# EAGLE design ControlPCB_2025-04-28 (EAGLE 9.6.2)
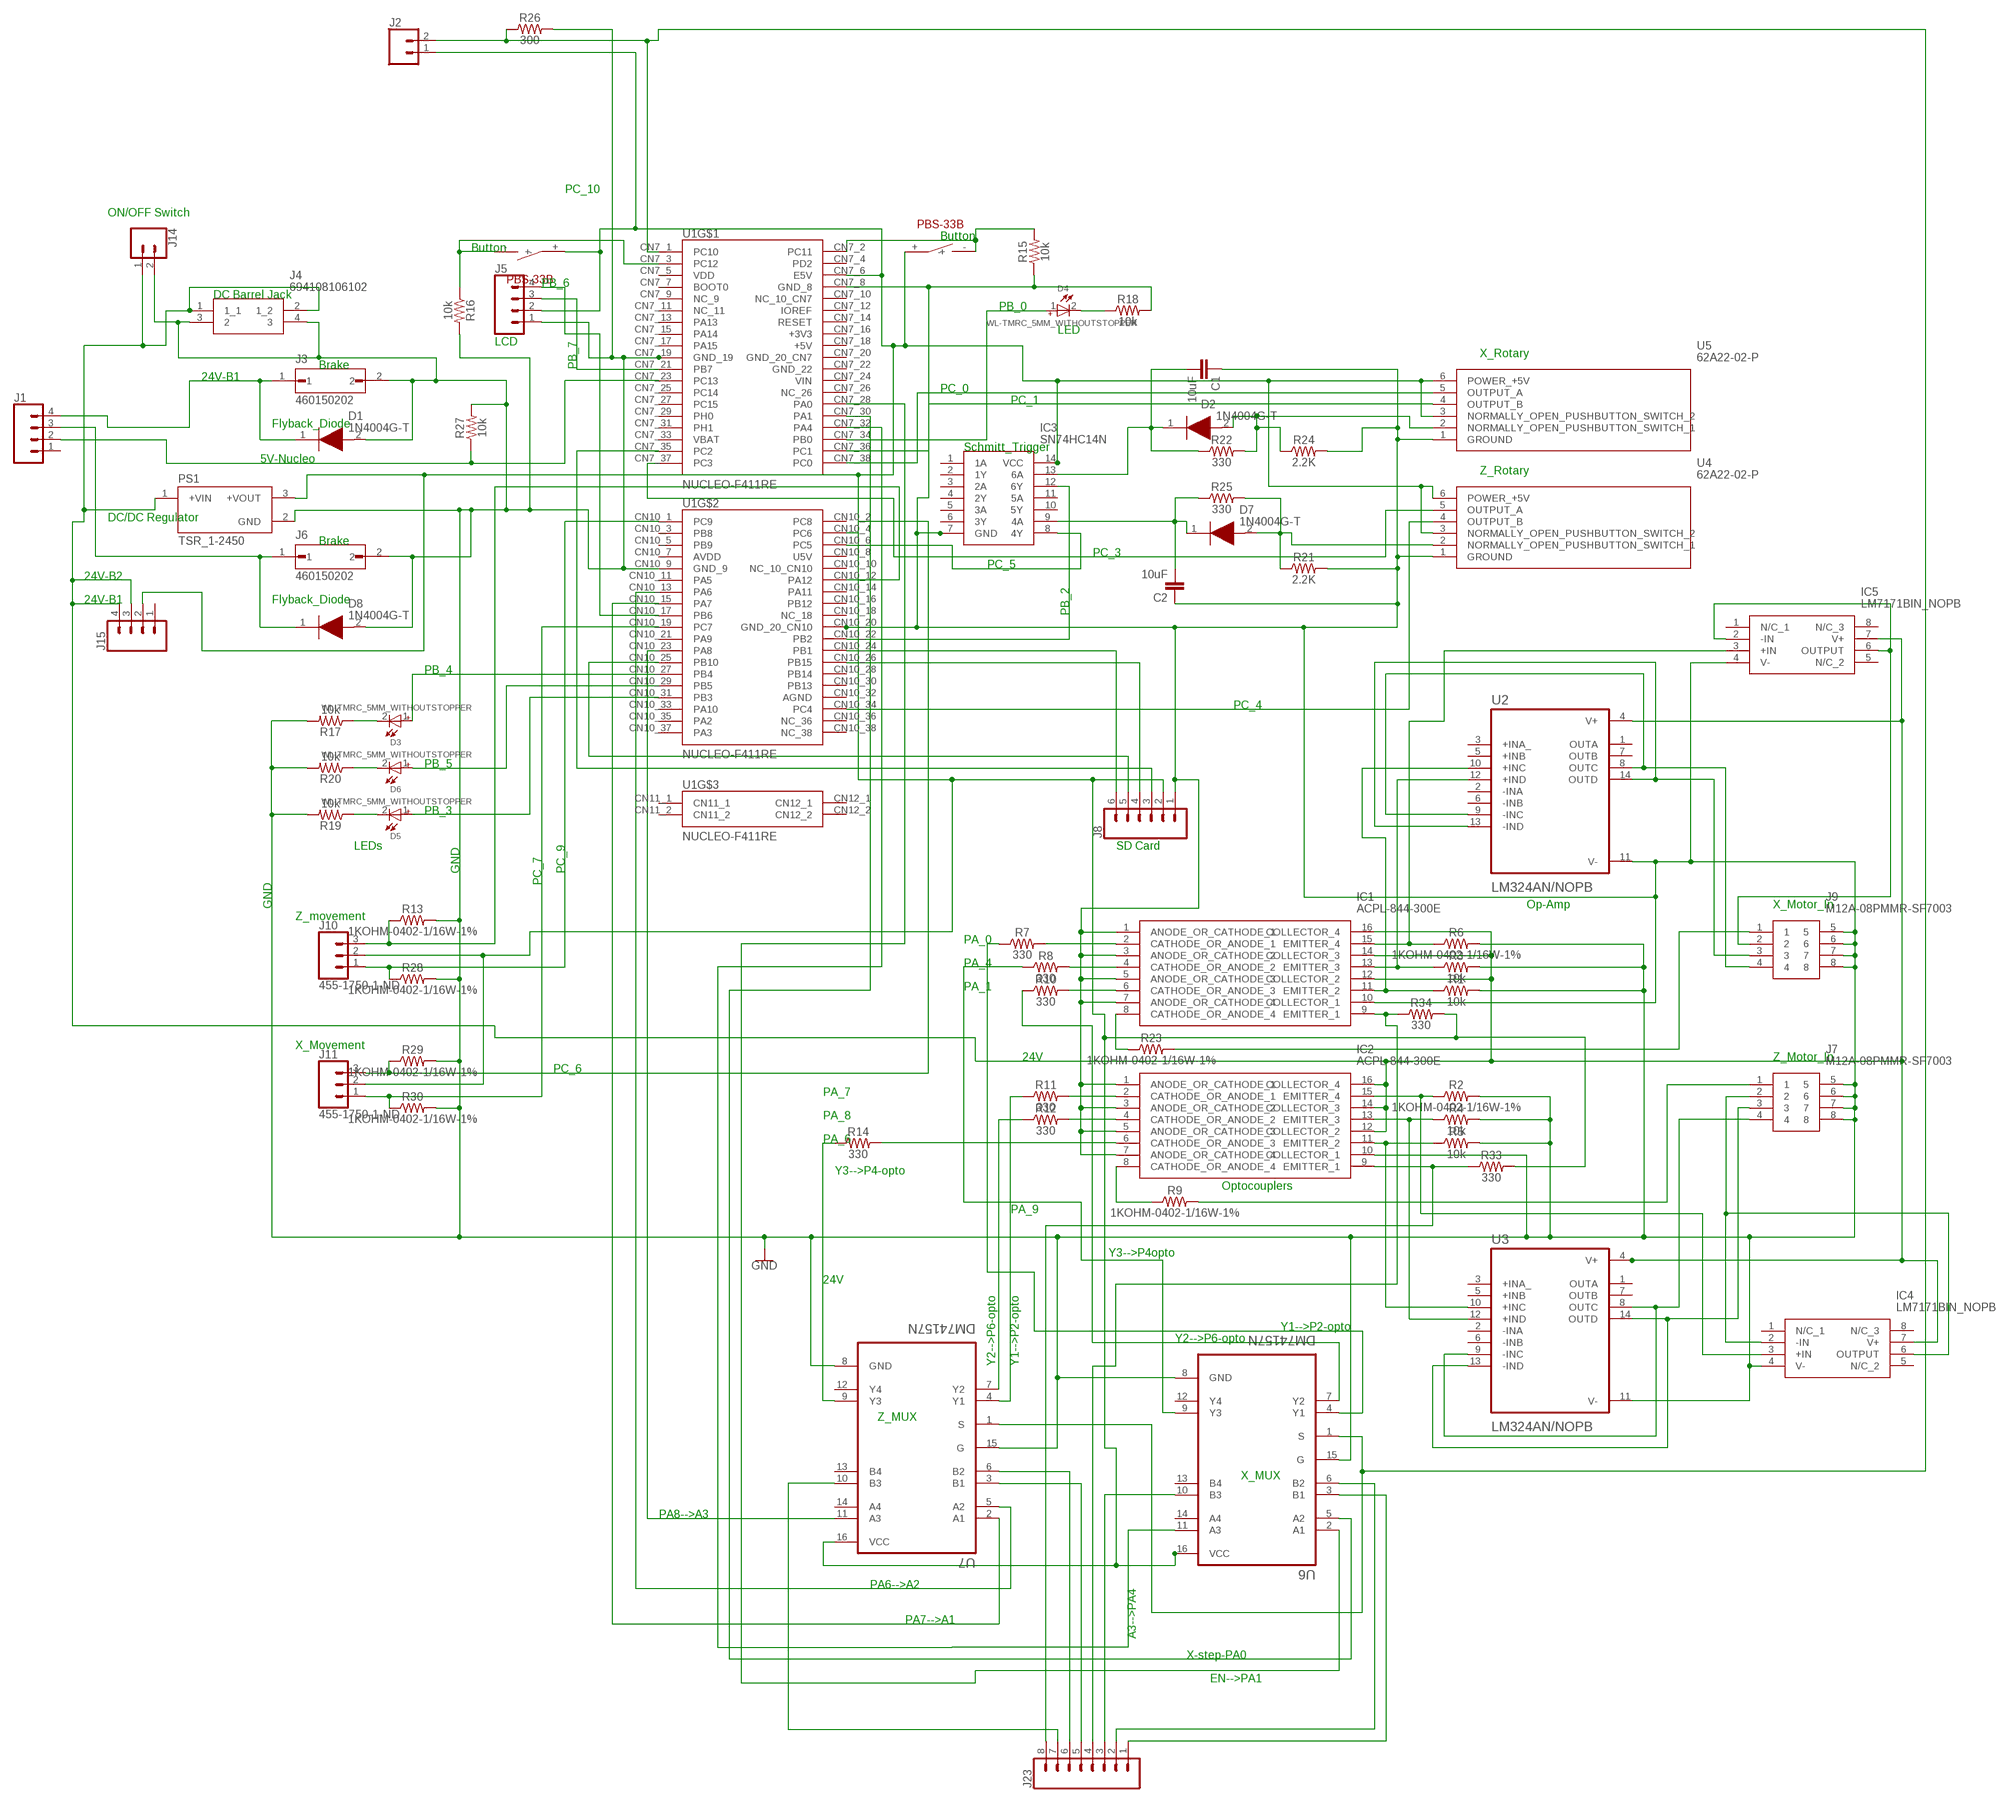
[diagram p0: schematic, sheet 1]

## Parts
C1  10uF  10UF-0603-6.3V-20%  [0603]
C2  10uF  10UF-0603-6.3V-20%  [0603]
D1  1N4004G-T  [DIOAD1408W86L464D236]
D2  1N4004G-T  [DIOAD1408W86L464D236]
D3  WL-TMRC_5MM_WITHOUTSTOPPER  [WL-TMRC_5MM]
D4  WL-TMRC_5MM_WITHOUTSTOPPER  [WL-TMRC_5MM]
D5  WL-TMRC_5MM_WITHOUTSTOPPER  [WL-TMRC_5MM]
D6  WL-TMRC_5MM_WITHOUTSTOPPER  [WL-TMRC_5MM]
D7  1N4004G-T  [DIOAD1408W86L464D236]
D8  1N4004G-T  [DIOAD1408W86L464D236]
IC1  ACPL-844-300E  [DIP880W60P254L1984H450Q16N]
IC2  ACPL-844-300E  [DIP880W60P254L1984H450Q16N]
IC3  SN74HC14N  [DIP794W53P254L1930H508Q14N]
IC4  LM7171BIN_NOPB  [DIP794W53P254L959H508Q8N]
IC5  LM7171BIN_NOPB  [DIP794W53P254L959H508Q8N]
J1  CONN_04PTH  [1X04]
J2  CONN_02  [1X02]
J3  460150202  [MOLEX_460150202]
J4  694108106102  [694108106102]
J5  CONN_04LOCK  [1X04_LOCK]
J6  460150202  [MOLEX_460150202]
J7  M12A-08PMMR-SF7003  [M12A08PMMRSF7003]
J8  CONN_06SILK_FEMALE_PTH  [1X06]
J9  M12A-08PMMR-SF7003  [M12A08PMMRSF7003]
J10  455-1750-1-ND  CONN_03  [1X03]
J11  455-1750-1-ND  CONN_03  [1X03]
J14  CONN_02  [1X02]
J15  CONN_04PTH  [1X04]
J23  CONN_08"  [1X08]
PS1  TSR_1-2450  [CONV_TSR_1-2450]
R1  10k  10KOHM-0402-1/16W-1%  [0402]
R2  1KOHM-0402-1/16W-1%  [0402]
R3  10k  10KOHM-0402-1/16W-1%  [0402]
R4  10k  10KOHM-0402-1/16W-1%  [0402]
R5  10k  10KOHM-0402-1/16W-1%  [0402]
R6  1KOHM-0402-1/16W-1%  [0402]
R7  330  330OHM-0402-1/16W-5%  [0402]
R8  330  330OHM-0402-1/16W-5%  [0402]
R9  1KOHM-0402-1/16W-1%  [0402]
R10  330  330OHM-0402-1/16W-5%  [0402]
R11  330  330OHM-0402-1/16W-5%  [0402]
R12  330  330OHM-0402-1/16W-5%  [0402]
R13  1KOHM-0402-1/16W-1%  [0402]
R14  330  330OHM-0402-1/16W-5%  [0402]
R15  10k  10KOHM-0402-1/16W-1%  [0402]
R16  10k  10KOHM-0402-1/16W-1%  [0402]
R17  10k  10KOHM-0402-1/16W-1%  [0402]
R18  10k  10KOHM-0402-1/16W-1%  [0402]
R19  10k  10KOHM-0402-1/16W-1%  [0402]
R20  10k  10KOHM-0402-1/16W-1%  [0402]
R21  2.2K  2.2KOHM-0402-1/16W-1%  [0402]
R22  330  330OHM-0402-1/16W-5%  [0402]
R23  1KOHM-0402-1/16W-1%  [0402]
R24  2.2K  2.2KOHM-0402-1/16W-1%  [0402]
R25  330  330OHM-0402-1/16W-5%  [0402]
R26  300  300OHM-0603-1/10W-1%  [0603]
R27  10k  10KOHM-0402-1/16W-1%  [0402]
R28  1KOHM-0402-1/16W-1%  [0402]
R29  1KOHM-0402-1/16W-1%  [0402]
R30  1KOHM-0402-1/16W-1%  [0402]
R33  330  330OHM-0402-1/16W-5%  [0402]
R34  330  330OHM-0402-1/16W-5%  [0402]
U1  NUCLEO-F411RE  [BOARD_NUCLEO-F411RE]
U2  LM324AN/NOPB  [DIP794W45P254L1969H508Q14]
U3  LM324AN/NOPB  [DIP794W45P254L1969H508Q14]
U4  62A22-02-P  [62A2202P]
U5  62A22-02-P  [62A2202P]
U6  DM74157N  [DIP794W45P254L1918H533Q16]
U7  DM74157N  [DIP794W45P254L1918H533Q16]
U$1  PBS-33B  [PBS-33B]
U$2  PBS-33B  [PBS-33B]

## Nets
GND: C1.1 C2.1 D1.2(A) D8.2(A) IC1.1(ANODE_OR_CATHODE_1) IC1.3(ANODE_OR_CATHODE_2) IC1.5(ANODE_OR_CATHODE_3) IC1.7(ANODE_OR_CATHODE_4) IC1.10(COLLECTOR_1) IC2.1(ANODE_OR_CATHODE_1) IC2.3(ANODE_OR_CATHODE_2) IC2.5(ANODE_OR_CATHODE_3) IC2.7(ANODE_OR_CATHODE_4) IC2.10(COLLECTOR_1) IC3.7(GND) IC4.4(V-) IC5.4(V-) J3.2 J4.3 J4.4 J5.1 J6.2 J7.5 J7.6 J7.7 J7.8 J8.1 J9.5 J9.6 J9.7 J9.8 J14.2 PS1.2(GND) R1.2 R2.2 R3.2 R4.2 R5.2 R6.2 R13.2 R15.1 R16.2 R17.2 R18.2 R19.2 R20.2 R21.2 R24.2 R26.2 R27.2 R28.2 R29.2 R30.2 U1.CN7_8(GND_8) U1.CN7_19(GND_19) U1.CN10_9(GND_9) U1.CN10_20(GND_20_CN10) U2.11(V-) U3.11(V-) U4.1(GROUND) U5.1(GROUND) U6.8(GND) U6.15(G) U7.8(GND) U7.15(G)
N$1: J10.1 R28.1 U1.CN10_1(PC9)
N$2: J9.4 U2.8(OUTC) U2.9(-INC)
N$3: C2.2 D7.1(K) IC3.9(4A) R25.1
N$4: IC2.9(EMITTER_1) J23.8 R33.1
N$5: IC2.2(CATHODE_OR_ANODE_1) R11.2
N$6: D8.1(K) J1.3 J6.1
N$7: J7.3 U3.13(-IND) U3.14(OUTD)
N$8: IC2.8(CATHODE_OR_ANODE_4) R9.1
N$9: IC3.14(VCC) J2.1 J5.2 J8.2 J10.2 J11.2 J15.2 PS1.3(+VOUT) R33.2 R34.2 U1.CN7_6(E5V) U4.3(NORMALLY_OPEN_PUSHBUTTON_SWITCH_2) U4.6(POWER_+5V) U5.3(NORMALLY_OPEN_PUSHBUTTON_SWITCH_2) U5.6(POWER_+5V) U6.16(VCC) U7.16(VCC) U$1.+ U$2.+
N$10: J7.4 U3.8(OUTC) U3.9(-INC)
N$11: D1.1(K) J1.4 J3.1
N$12: J7.1 R9.2
N$13: IC1.4(CATHODE_OR_ANODE_2) R8.2
N$14: IC4.2(-IN) IC4.6(OUTPUT) J7.2
N$15: R10.1 U6.7(Y2)
N$16: IC1.15(EMITTER_4) IC5.3(+IN) R6.1
N$17: J23.7 U7.10(B3)
N$19: J23.6 U7.6(B2)
N$20: IC1.8(CATHODE_OR_ANODE_4) R23.1
N$21: IC5.2(-IN) IC5.6(OUTPUT) J9.2
N$22: J23.5 U7.3(B1)
N$23: J1.2 R27.1 U1.CN7_23(PC13)
N$25: R16.1 U1.CN7_3(PC12) U$2.-
N$26: R15.2 U1.CN7_2(PC11) U$1.-
N$27: IC3.12(6Y) U1.CN10_22(PB2)
N$28: U1.CN7_32(PA4) U6.11(A3)
N$29: IC2.11(EMITTER_2) R5.1 U3.10(+INC)
N$30: U1.CN7_37(PC3) U4.5(OUTPUT_A)
N$32: R12.1 U7.7(Y2)
N$34: IC1.2(CATHODE_OR_ANODE_1) R7.2
N$35: IC1.12(COLLECTOR_2) IC1.14(COLLECTOR_3) IC1.16(COLLECTOR_4) IC2.12(COLLECTOR_2) IC2.14(COLLECTOR_3) IC2.16(COLLECTOR_4) IC4.7(V+) IC5.7(V+) J4.1(1_1) J4.2(1_2) J14.1 J15.3 J15.4 PS1.1(+VIN) U2.4(V+) U3.4(V+)
N$36: R7.1 U6.4(Y1)
N$38: IC1.6(CATHODE_OR_ANODE_3) R10.2
N$39: IC2.4(CATHODE_OR_ANODE_2) R12.2
N$40: U1.CN10_15(PA7) U7.2(A1)
N$41: D7.2(A) R21.1 R25.2 U4.2(NORMALLY_OPEN_PUSHBUTTON_SWITCH_1)
N$42: R11.1 U7.4(Y1)
N$43: U1.CN7_38(PC0) U5.5(OUTPUT_A)
N$44: IC1.9(EMITTER_1) J23.4 R34.1
N$45: J9.3 U2.13(-IND) U2.14(OUTD)
N$46: U1.CN10_34(PC4) U4.4(OUTPUT_B)
N$47: C1.2 D2.1(K) IC3.13(6A) R22.1
N$49: D4.1(+) U1.CN7_34(PB0)
N$50: J5.4 U1.CN10_17(PB6)
N$51: D6.2(-) R20.1
N$52: D5.2(-) R19.1
N$53: D4.2(-) R18.1
N$54: D3.2(-) R17.1
N$55: J8.4 U1.CN10_26(PB15)
N$56: J8.5 U1.CN10_25(PB10)
N$57: R14.1 U7.9(Y3)
N$58: J9.1 R23.2
N$60: U1.CN10_13(PA6) U7.5(A2)
N$61: U1.CN7_30(PA1) U6.5(A2)
N$62: U1.CN7_28(PA0) U6.2(A1)
N$65: D3.1(+) U1.CN10_27(PB4)
N$66: D6.1(+) U1.CN10_29(PB5)
N$67: J5.3 U1.CN7_21(PB7)
N$68: J23.3 U6.10(B3)
N$69: J23.2 U6.6(B2)
N$70: D5.1(+) U1.CN10_31(PB3)
N$71: U1.CN10_23(PA8) U7.11(A3)
N$73: U1.CN7_36(PC1) U5.4(OUTPUT_B)
N$74: J23.1 U6.3(B1)
N$75: D2.2(A) R22.2 R24.1 U5.2(NORMALLY_OPEN_PUSHBUTTON_SWITCH_1)
N$76: J8.6 U1.CN10_24(PB1)
N$77: IC3.8(4Y) U1.CN10_6(PC5)
N$78: J8.3 U1.CN7_35(PC2)
N$81: J2.2 R26.1 U1.CN7_1(PC10) U6.1(S) U7.1(S)
N$82: J10.3 R13.1 U1.CN10_12(PA12)
N$84: J11.3 R29.1 U1.CN10_4(PC6)
N$87: J11.1 R30.1 U1.CN10_19(PC7)
N$88: IC1.13(EMITTER_3) R3.1 U2.12(+IND)
N$89: IC2.13(EMITTER_3) R4.1 U3.12(+IND)
N$94: IC2.6(CATHODE_OR_ANODE_3) R14.2
N$99: R8.1 U6.9(Y3)
N$105: IC1.11(EMITTER_2) R1.1 U2.10(+INC)
N$107: IC2.15(EMITTER_4) IC4.3(+IN) R2.1
Unconnected: IC3.1(1A) IC3.2(1Y) IC3.3(2A) IC3.4(2Y) IC3.5(3A) IC3.6(3Y) IC3.10(5Y) IC3.11(5A) IC4.1(N/C_1) IC4.5(N/C_2) IC4.8(N/C_3) IC5.1(N/C_1) IC5.5(N/C_2) IC5.8(N/C_3) J1.1 J15.1 U1.CN7_4(PD2) U1.CN7_7(BOOT0) U1.CN7_9(NC_9) U1.CN7_10(NC_10_CN7) U1.CN7_11(NC_11) U1.CN7_12(IOREF) U1.CN7_13(PA13) U1.CN7_14(RESET) U1.CN7_15(PA14) U1.CN7_17(PA15) U1.CN7_24(VIN) U1.CN7_25(PC14) U1.CN7_26(NC_26) U1.CN7_27(PC15) U1.CN7_29(PH0) U1.CN7_31(PH1) U1.CN10_2(PC8) U1.CN10_3(PB8) U1.CN10_5(PB9) U1.CN10_10(NC_10_CN10) U1.CN10_11(PA5) U1.CN10_14(PA11) U1.CN10_16(PB12) U1.CN10_18(NC_18) U1.CN10_21(PA9) U1.CN10_28(PB14) U1.CN10_30(PB13) U1.CN10_33(PA10) U1.CN10_35(PA2) U1.CN10_36(NC_36) U1.CN10_37(PA3) U1.CN10_38(NC_38) U1.CN11_1 U1.CN11_2 U1.CN12_1 U1.CN12_2 U2.1(OUTA) U2.2(-INA) U2.3(+INA_) U2.5(+INB) U2.6(-INB) U2.7(OUTB) U3.1(OUTA) U3.2(-INA) U3.3(+INA_) U3.5(+INB) U3.6(-INB) U3.7(OUTB) U6.12(Y4) U6.13(B4) U6.14(A4) U7.12(Y4) U7.13(B4) U7.14(A4)

## Notes on the sheet
- PC_10
- ON/OFF Switch
- Button
- Button
- PB_6
- DC Barrel Jack
- PB_0
- LED
- LCD
- X_Rotary
- Brake | PB_7
- 24V-B1
- PC_0
- PC_1
- Flyback_Diode
- Schmitt_Trigger
- 5V-Nucleo
- Z_Rotary
- DC/DC Regulator
- Brake
- PC_3
- PC_5
- 24V-B2
- 24V-B1 | Flyback_Diode
- PB_2
- PB_4
- PC_4
- PB_5
- PB_3
- LEDs | SD Card
- GND | PC_9
- PC_7
- GND | Op-Amp | X_Motor_In
- Z_movement
- PA_0
- PA_4
- PA_1
- X_Movement
- 24V | Z_Motor_In
- PC_6
- PA_7
- PA_8
- PA_6
- Y3-->P4-opto
- Optocouplers
- PA_9
- Y3-->P4opto
- 24V
- Y2-->P6-opto | Y1-->P2-opto
- Y1-->P2-opto
- Y2-->P6-opto
- Z_MUX
- X_MUX
- PA8-->A3
- PA6-->A2 | A3-->PA4
- PA7-->A1
- X-step-PA0
- EN-->PA1

## Power pins joined to a net without a drawn wire
+3V3: U1.CN7_16(+3V3)
+5V: U1.CN7_18(+5V)
AGND: U1.CN10_32(AGND)
AVDD: U1.CN10_7(AVDD)
GND_20_CN7: U1.CN7_20(GND_20_CN7)
GND_22: U1.CN7_22(GND_22)
U5V: U1.CN10_8(U5V)
VBAT: U1.CN7_33(VBAT)
VDD: U1.CN7_5(VDD)

## Library data of the parts
C1 C2 = SparkFun-Capacitors:10UF: 10.0µF ceramic capacitors A capacitor is a passive two-terminal electrical component used to store electrical energy temporarily in an electric field.; PROD_ID: CAP-11015
D1 D2 D7 D8 = 1N4004G-T:1N4004G-T: Rectifiers 1.0A 400V Source: Datasheet <https://www.diodes.com/assets/Datasheets/ds29002.pdf>; ARROW_PART_NUMBER: 1N4004G-T; ARROW_PRICE-STOCK: https://www.arrow.com/en/products/1n4004g-t/diodes-incorporated?region=nac; DESCRIPTION: Rectifiers 1.0A 400V; HEIGHT: mm; MANUFACTURER_NAME: Diodes Incorporated; MANUFACTURER_PART_NUMBER: 1N4004G-T; MOUSER_PART_NUMBER: 621-1N4004G-T; MOUSER_PRICE-STOCK: https://www.mouser.co.uk/ProductDetail/Diodes-Incorporated/1N4004G-T?qs=rGAXPo9uwV0Lm2ZC2xbEvw%3D%3D
D3-D6 = WL-TMRC_5MM:WL-TMRC_5MM
IC1 IC2 = ACPL-844-300E:ACPL-844-300E: Broadcom, ACPL-844-300E AC Input Phototransistor Output Quad Optocoupler, Surface Mount, 16-Pin PDIP Source: Datasheet <http://www.avagotech.com/docs/AV01-0475EN>; DESCRIPTION: Broadcom, ACPL-844-300E AC Input Phototransistor Output Quad Optocoupler, Surface Mount, 16-Pin PDIP; HEIGHT: 4.5mm; MANUFACTURER_NAME: Avago Technologies; MANUFACTURER_PART_NUMBER: ACPL-844-300E; MOUSER_PART_NUMBER: 630-ACPL-844-300E; MOUSER_PRICE-STOCK: https://www.mouser.co.uk/ProductDetail/Broadcom-Avago/ACPL-844-300E?qs=RuhU64sK2%252BvgcKbLWHwX4Q%3D%3D
IC3 = SN74HC14N:SN74HC14N: Hex invertor,SN74HC14N DIP14 2-6V 25pcs Source: Datasheet <http://componentsearchengine.com/Datasheets/3/SN74HC14N.pdf>; ARROW_PART_NUMBER: SN74HC14N; ARROW_PRICE-STOCK: https://www.arrow.com/en/products/sn74hc14n/texas-instruments?utm_currency=USD&region=nac; DESCRIPTION: Hex invertor,SN74HC14N DIP14 2-6V 25pcs; HEIGHT: 5.08mm; MANUFACTURER_NAME: Texas Instruments; MANUFACTURER_PART_NUMBER: SN74HC14N; MOUSER_PART_NUMBER: 595-SN74HC14N; MOUSER_PRICE-STOCK: https://www.mouser.co.uk/ProductDetail/Texas-Instruments/SN74HC14N?qs=tJ5HNKWh3OVki9FUzGEzjg%3D%3D
IC4 IC5 = LM7171BIN_NOPB:LM7171BIN_NOPB: Texas Instruments LM7171BIN/NOPB Op Amp, 125MHz, 6 28 V, 8-Pin MDIP Source: Datasheet <http://www.ti.com/lit/gpn/lm7171>; ARROW_PART_NUMBER: LM7171BIN/NOPB; ARROW_PRICE-STOCK: https://www.arrow.com/en/products/lm7171binnopb/texas-instruments?region=nac; DESCRIPTION: Texas Instruments LM7171BIN/NOPB Op Amp, 125MHz, 6 28 V, 8-Pin MDIP; HEIGHT: 5.08mm; MANUFACTURER_NAME: Texas Instruments; MANUFACTURER_PART_NUMBER: LM7171BIN/NOPB; MOUSER_PART_NUMBER: 926-LM7171BIN/NOPB; MOUSER_PRICE-STOCK: https://www.mouser.co.uk/ProductDetail/Texas-Instruments/LM7171BIN-NOPB?qs=QbsRYf82W3GfY2rfAj93dw%3D%3D
J1 J5 J15 = SparkFun-Connectors:CONN_04: Multi connection point. Often used as Generic Header-pin footprint for 0.1 inch spaced/style header connections On any of the 0.1 inch spaced packages, you can populate with these: Break Away Headers - Straight <https://www.sparkfun.com/products/116> (PRT-00116) Break Away Male Headers - Right Angle <https://www.sparkfun.com/products/553> (PRT-00553) Female Headers <https://www.sparkfun.com/products/115> (PRT-00115) Break Away Headers - Machine Pin <https://www.sparkfun.com/products/117> (PRT-00117) Break Away Female Headers - Swiss Machine Pin <https://www.sparkfun.com/products/743> (PRT-00743) For SCREWTERMINALS and SPRING TERMINALS visit here: Screw Terimnals on SparkFun.com <https://www.sparkfun.com/search/results?term=Screw+Terminals> (5mm/3.5mm/2.54mm spacing) This device is also useful as a general connection point to wire up your design to another part of your project. Our various solder wires solder well into these plated through hole pads. Hook-Up Wire - Assortment (Stranded, 22 AWG) <https://www.sparkfun.com/products/11375> (PRT-11375) Hook-Up Wire - Assortment (Solid Core, 22 AWG) <https://www.sparkfun.com/products/11367> (PRT-11367) View the entire wire category on our website here <https://www.sparkfun.com/categories/141> Special notes: Molex polarized connector foot print use with SKU : PRT-08231 with associated crimp pins and housings. 1MM SMD Version SKU: PRT-10208; PROD_ID: CONN-09696
J2 J14 = SparkFun-Connectors:CONN_02: Multi connection point. Often used as Generic Header-pin footprint for 0.1 inch spaced/style header connections On any of the 0.1 inch spaced packages, you can populate with these: Break Away Headers - Straight <https://www.sparkfun.com/products/116> (PRT-00116) Break Away Male Headers - Right Angle <https://www.sparkfun.com/products/553> (PRT-00553) Female Headers <https://www.sparkfun.com/products/115> (PRT-00115) Break Away Headers - Machine Pin <https://www.sparkfun.com/products/117> (PRT-00117) Break Away Female Headers - Swiss Machine Pin <https://www.sparkfun.com/products/743> (PRT-00743) For SCREWTERMINALS and SPRING TERMINALS visit here: Screw Terimnals on SparkFun.com <https://www.sparkfun.com/search/results?term=Screw+Terminals> (5mm/3.5mm/2.54mm spacing) This device is also useful as a general connection point to wire up your design to another part of your project. Our various solder wires solder well into these plated through hole pads. Hook-Up Wire - Assortment (Stranded, 22 AWG) <https://www.sparkfun.com/products/11375> (PRT-11375) Hook-Up Wire - Assortment (Solid Core, 22 AWG) <https://www.sparkfun.com/products/11367> (PRT-11367) View the entire wire category on our website here <https://www.sparkfun.com/categories/141> Special notes: Molex polarized connector foot print use with: PRT-08233 with associated crimp pins and housings. 2.54_SCREWTERM for use with PRT-10571. 3.5mm Screw Terminal footprints for PRT-08084 5mm Screw Terminal footprints for use with PRT-08432
J3 J6 = 460150202:460150202; MANUFACTURER: Molex; MAXIMUM_PACKAGE_HEIGHT: 12.80mm; PARTREV: M4; STANDARD: Manufacturer Recommendations
J4 = 694108106102:694108106102: WURTH ELEKTRONIK - 694108106102 - CONNECTOR, POWER ENTRY, JACK, 5A, 24VDC Source: Datasheet <http://katalog.we-online.de/em/datasheet/6941xx106102.pdf>; DESCRIPTION: WURTH ELEKTRONIK - 694108106102 - CONNECTOR, POWER ENTRY, JACK, 5A, 24VDC; HEIGHT: 11mm; MANUFACTURER_NAME: Wurth Elektronik; MANUFACTURER_PART_NUMBER: 694108106102; MOUSER_PART_NUMBER: 710-694108106102; MOUSER_PRICE-STOCK: https://www.mouser.co.uk/ProductDetail/Wurth-Elektronik/694108106102?qs=a9WhcLg8qCwOtilTS%252B%2FAyw%3D%3D
J7 J9 = M12A-08PMMR-SF7003:M12A-08PMMR-SF7003: Sensor Cables / Actuator Cables PANEL SCREW 8 PIN M CONN M PIN Source: Datasheet <https://www.digikey.com/htmldatasheets/production/3171852/0/0/1/m12a-08pmmr-sf7003.pdf>; ARROW_PART_NUMBER: M12A-08PMMR-SF7003; ARROW_PRICE-STOCK: https://www.arrow.com/en/products/m12a-08pmmr-sf7003/amphenol?region=europe; DESCRIPTION: Sensor Cables / Actuator Cables PANEL SCREW 8 PIN M CONN M PIN; HEIGHT: 16.25mm; MANUFACTURER_NAME: Amphenol; MANUFACTURER_PART_NUMBER: M12A-08PMMR-SF7003; MOUSER_PART_NUMBER: 523-M12A08PMMRSF7003; MOUSER_PRICE-STOCK: https://www.mouser.com/Search/Refine.aspx?Keyword=523-M12A08PMMRSF7003
J8 = SparkFun-Connectors:CONN_06: Multi connection point. Often used as Generic Header-pin footprint for 0.1 inch spaced/style header connections On any of the 0.1 inch spaced packages, you can populate with these: Break Away Headers - Straight <https://www.sparkfun.com/products/116> (PRT-00116) Break Away Male Headers - Right Angle <https://www.sparkfun.com/products/553> (PRT-00553) Female Headers <https://www.sparkfun.com/products/115> (PRT-00115) Break Away Headers - Machine Pin <https://www.sparkfun.com/products/117> (PRT-00117) Break Away Female Headers - Swiss Machine Pin <https://www.sparkfun.com/products/743> (PRT-00743) Arduino Stackable Header - 6 Pin <https://www.sparkfun.com/products/9280> (PRT-09280) Screw Terminals 2.54mm Pitch (6-Pin) <https://www.sparkfun.com/products/16499> (PRT-16499) For SCREWTERMINALS and SPRING TERMINALS visit here: Screw Terimnals on SparkFun.com <https://www.sparkfun.com/search/results?term=Screw+Terminals> (5mm/3.5mm/2.54mm spacing) This device is also useful as a general connection point to wire up your design to another part of your project. Our various solder wires solder well into these plated through hole pads. Hook-Up Wire - Assortment (Stranded, 22 AWG) <https://www.sparkfun.com/products/11375> (PRT-11375) Hook-Up Wire - Assortment (Solid Core, 22 AWG) <https://www.sparkfun.com/products/11367> (PRT-11367) View the entire wire category on our website here <https://www.sparkfun.com/categories/141>; PROD_ID: CONN-08437
J10 J11 = SparkFun-Connectors:CONN_03: Multi connection point. Often used as Generic Header-pin footprint for 0.1 inch spaced/style header connections On any of the 0.1 inch spaced packages, you can populate with these: Break Away Headers - Straight <https://www.sparkfun.com/products/116> (PRT-00116) Break Away Male Headers - Right Angle <https://www.sparkfun.com/products/553> (PRT-00553) Female Headers <https://www.sparkfun.com/products/115> (PRT-00115) Break Away Headers - Machine Pin <https://www.sparkfun.com/products/117> (PRT-00117) Break Away Female Headers - Swiss Machine Pin <https://www.sparkfun.com/products/743> (PRT-00743) Stackable Header - 3 Pin (Female, 0.1") <https://www.sparkfun.com/products/13875> (PRT-13875) For SCREWTERMINALS and SPRING TERMINALS visit here: Screw Terimnals on SparkFun.com <https://www.sparkfun.com/search/results?term=Screw+Terminals> (5mm/3.5mm/2.54mm spacing) This device is also useful as a general connection point to wire up your design to another part of your project. Our various solder wires solder well into these plated through hole pads. Hook-Up Wire - Assortment (Stranded, 22 AWG) <https://www.sparkfun.com/products/11375> (PRT-11375) Hook-Up Wire - Assortment (Solid Core, 22 AWG) <https://www.sparkfun.com/products/11367> (PRT-11367) View the entire wire category on our website here <https://www.sparkfun.com/categories/141> Special notes: Molex polarized connector foot print use with SKU : PRT-08232 with associated crimp pins and housings.; PROD_ID: XXX-00000
J23 = SparkFun-Connectors:CONN_08: Multi connection point. Often used as Generic Header-pin footprint for 0.1 inch spaced/style header connections On any of the 0.1 inch spaced packages, you can populate with these: Break Away Headers - Straight <https://www.sparkfun.com/products/116> (PRT-00116) Break Away Male Headers - Right Angle <https://www.sparkfun.com/products/553> (PRT-00553) Female Headers <https://www.sparkfun.com/products/115> (PRT-00115) Break Away Headers - Machine Pin <https://www.sparkfun.com/products/117> (PRT-00117) Break Away Female Headers - Swiss Machine Pin <https://www.sparkfun.com/products/743> (PRT-00743) Arduino Stackable Header - 8 Pin <https://www.sparkfun.com/products/9279> (PRT-09279) For SCREWTERMINALS and SPRING TERMINALS visit here: Screw Terimnals on SparkFun.com <https://www.sparkfun.com/search/results?term=Screw+Terminals> (5mm/3.5mm/2.54mm spacing) This device is also useful as a general connection point to wire up your design to another part of your project. Our various solder wires solder well into these plated through hole pads. Hook-Up Wire - Assortment (Stranded, 22 AWG) <https://www.sparkfun.com/products/11375> (PRT-11375) Hook-Up Wire - Assortment (Solid Core, 22 AWG) <https://www.sparkfun.com/products/11367> (PRT-11367) View the entire wire category on our website here <https://www.sparkfun.com/categories/141> Special notes: Molex polarized connector foot print use with SKU : PRT-08231 with associated crimp pins and housings. 1MM SMD Version SKU: PRT-10208 NOTES ON THE VARIANTS LOCK and LOCK_LONGPADS... This footprint was designed to help hold the alignment of a through-hole component (i.e. 6-pin header) while soldering it into place. You may notice that each hole has been shifted either up or down by 0.005 of an inch from it's more standard position (which is a perfectly straight line). This slight alteration caused the pins (the squares in the middle) to touch the edges of the holes. Because they are alternating, it causes a "brace" to hold the component in place. 0.005 has proven to be the perfect amount of "off-center" position when using our standard breakaway headers. Although looks a little odd when you look at the bare footprint, once you have a header in there, the alteration is very hard to notice. Also,if you push a header all the way into place, it is covered up entirely on the bottom side.; PROD_ID: CONN-08438
PS1 = TSR_1-2450:TSR_1-2450; MANUFACTURER: Traco Power; MAXIMUM_PACKAGE_HEIGHT: 10.6mm; PARTREV: Apr 27, 2020; STANDARD: Manufacturer Recommendations
R1 R3-R5 R15-R20 R27 = SparkFun-Resistors:10KOHM: 10kΩ resistor A resistor is a passive two-terminal electrical component that implements electrical resistance as a circuit element. Resistors act to reduce current flow, and, at the same time, act to lower voltage levels within circuits. - Wikipedia; PROD_ID: RES-14241
R2 R6 R9 R13 R23 R28-R30 = SparkFun-Resistors:1KOHM: 1kΩ resistor A resistor is a passive two-terminal electrical component that implements electrical resistance as a circuit element. Resistors act to reduce current flow, and, at the same time, act to lower voltage levels within circuits. - Wikipedia; PROD_ID: RES-14342
R7 R8 R10-R12 R14 R22 R25 R33 R34 = SparkFun-Resistors:330OHM: 330Ω resistor A resistor is a passive two-terminal electrical component that implements electrical resistance as a circuit element. Resistors act to reduce current flow, and, at the same time, act to lower voltage levels within circuits. - Wikipedia; PROD_ID: RES-15407
R21 R24 = SparkFun-Resistors:2.2KOHM: 2.2kΩ resistor A resistor is a passive two-terminal electrical component that implements electrical resistance as a circuit element. Resistors act to reduce current flow, and, at the same time, act to lower voltage levels within circuits. - Wikipedia; PROD_ID: RES-14341
R26 = SparkFun-Resistors:300OHM: 300Ω resistor A resistor is a passive two-terminal electrical component that implements electrical resistance as a circuit element. Resistors act to reduce current flow, and, at the same time, act to lower voltage levels within circuits. - Wikipedia; PROD_ID: RES-10328
U1 = NUCLEO-F411RE:NUCLEO-F411RE; CHECK_PRICES: https://www.snapeda.com/parts/NUCLEO-F411RE/STMicroelectronics/view-part/?ref=eda; DESCRIPTION: STM32F411RE, mbed-Enabled Development Nucleo-64 STM32F4 ARM® Cortex®-M4 MCU 32-Bit Embedded Evaluation Board; DIGIKEY_PART_NUMBER: 497-14711-ND; MF: STMicroelectronics; MP: NUCLEO-F411RE; PACKAGE: None; SNAPEDA_LINK: https://www.snapeda.com/parts/NUCLEO-F411RE/STMicroelectronics/view-part/?ref=snap
U2 U3 = LM324AN_NOPB:LM324AN/NOPB
U4 U5 = 62A22-02-P:62A22-02-P: Rotary Encoder Optical 16 Quadrature (Incremental) User Selectable Source: Datasheet <https://app-grayhill-website-cms-prod-001.azurewebsites.net/media/sidlewfq/62a-d-v-datasheet.pdf>; ARROW_PART_NUMBER: 62A22-02-P; ARROW_PRICE-STOCK: https://www.arrow.com/en/products/62a22-02-p/grayhill?region=nac; DESCRIPTION: Rotary Encoder Optical 16 Quadrature (Incremental) User Selectable; HEIGHT: 38.78mm; MANUFACTURER_NAME: Grayhill; MANUFACTURER_PART_NUMBER: 62A22-02-P; MOUSER_PART_NUMBER: 706-62A22-02-P; MOUSER_PRICE-STOCK: https://www.mouser.co.uk/ProductDetail/Grayhill/62A22-02-P?qs=ls7QRyWmRk6o89xMir9opA%3D%3D
U6 U7 = DM74157N:DM74157N: Check availability <https://pricing.snapeda.com/parts/DM74157N/ON%20Semiconductor/view-part?ref=eda>; AVAILABILITY: In Stock; CHECK_PRICES: https://www.snapeda.com/parts/DM74157N/Onsemi/view-part/?ref=eda; DESCRIPTION: IC MULTIPLEXER 4 X 2:1 16DIP; MF: ON Semiconductor; MP: DM74157N; PACKAGE: PDIP-16 ON Semiconductor; PRICE: None; SNAPEDA_LINK: https://www.snapeda.com/parts/DM74157N/Onsemi/view-part/?ref=snap
U$1 U$2 = PBS-33B:PBS-33B

## Board
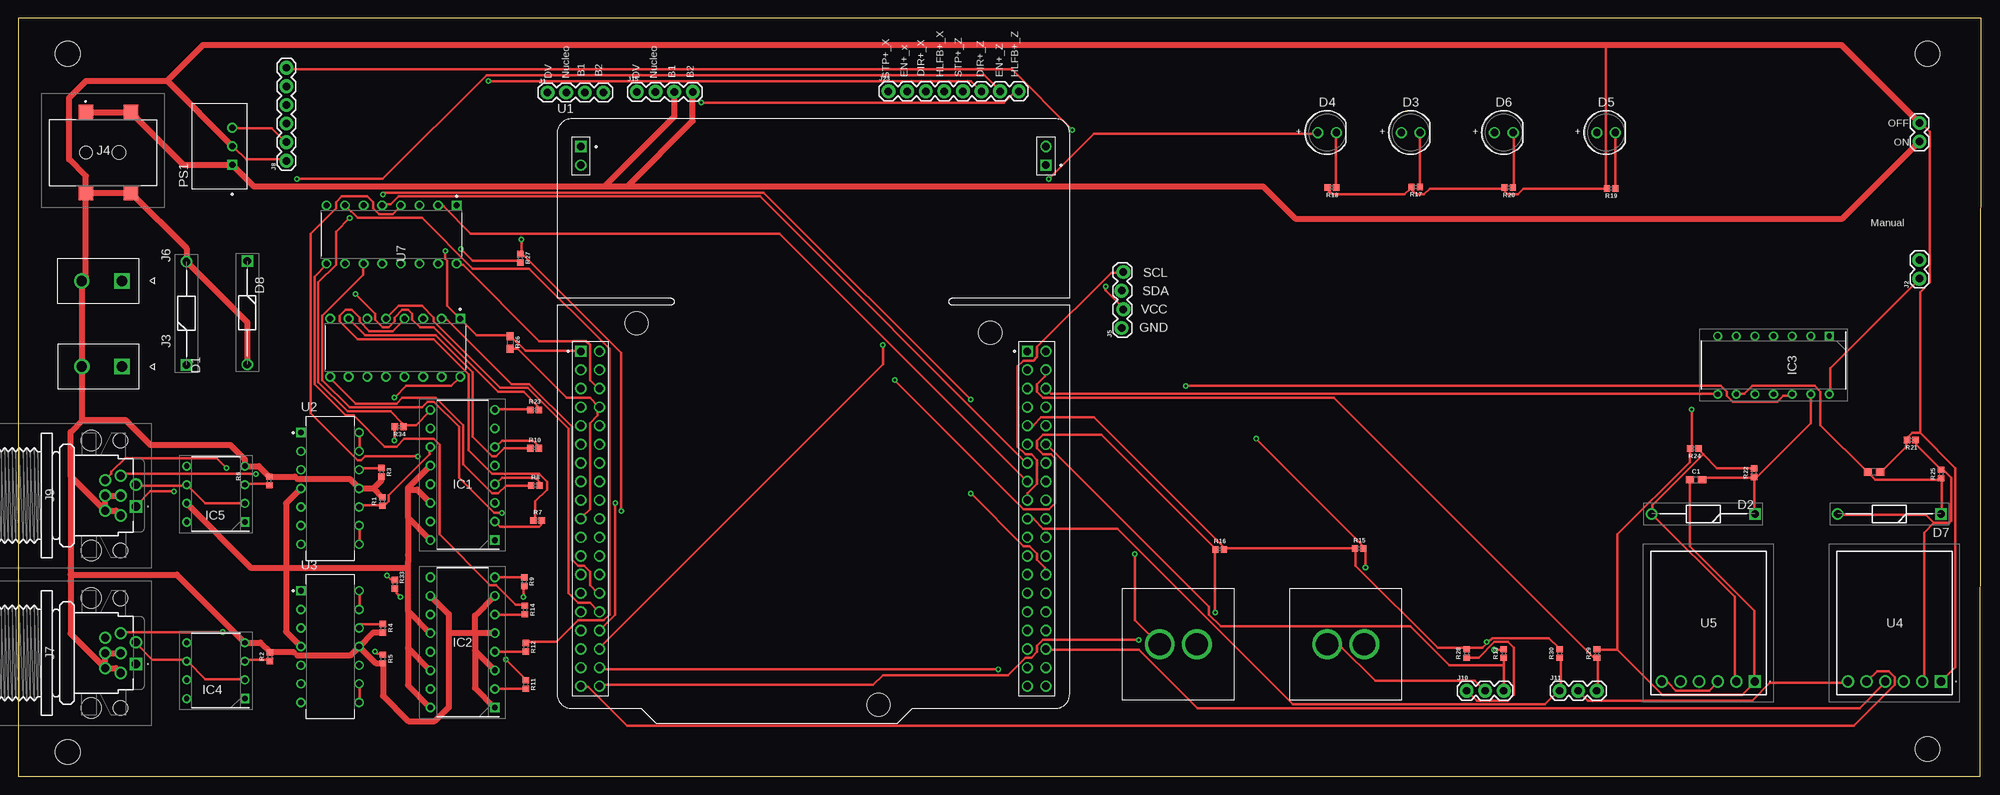
[diagram p1: board, top side]
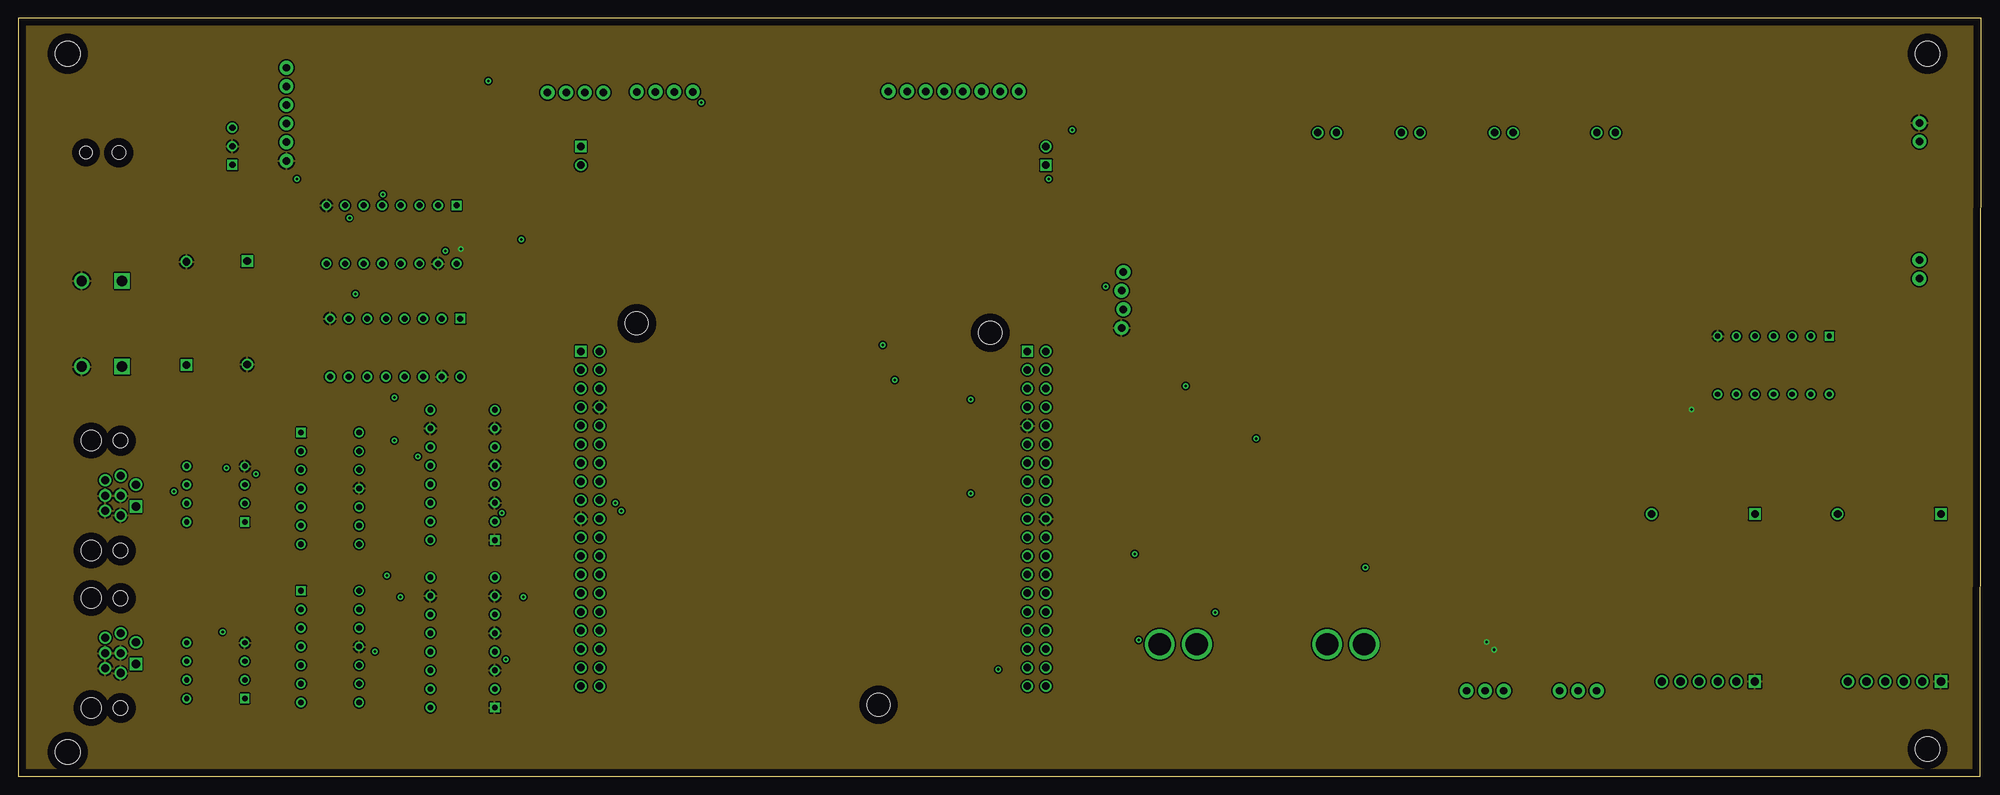
[diagram p2: board, inner layer Route2]
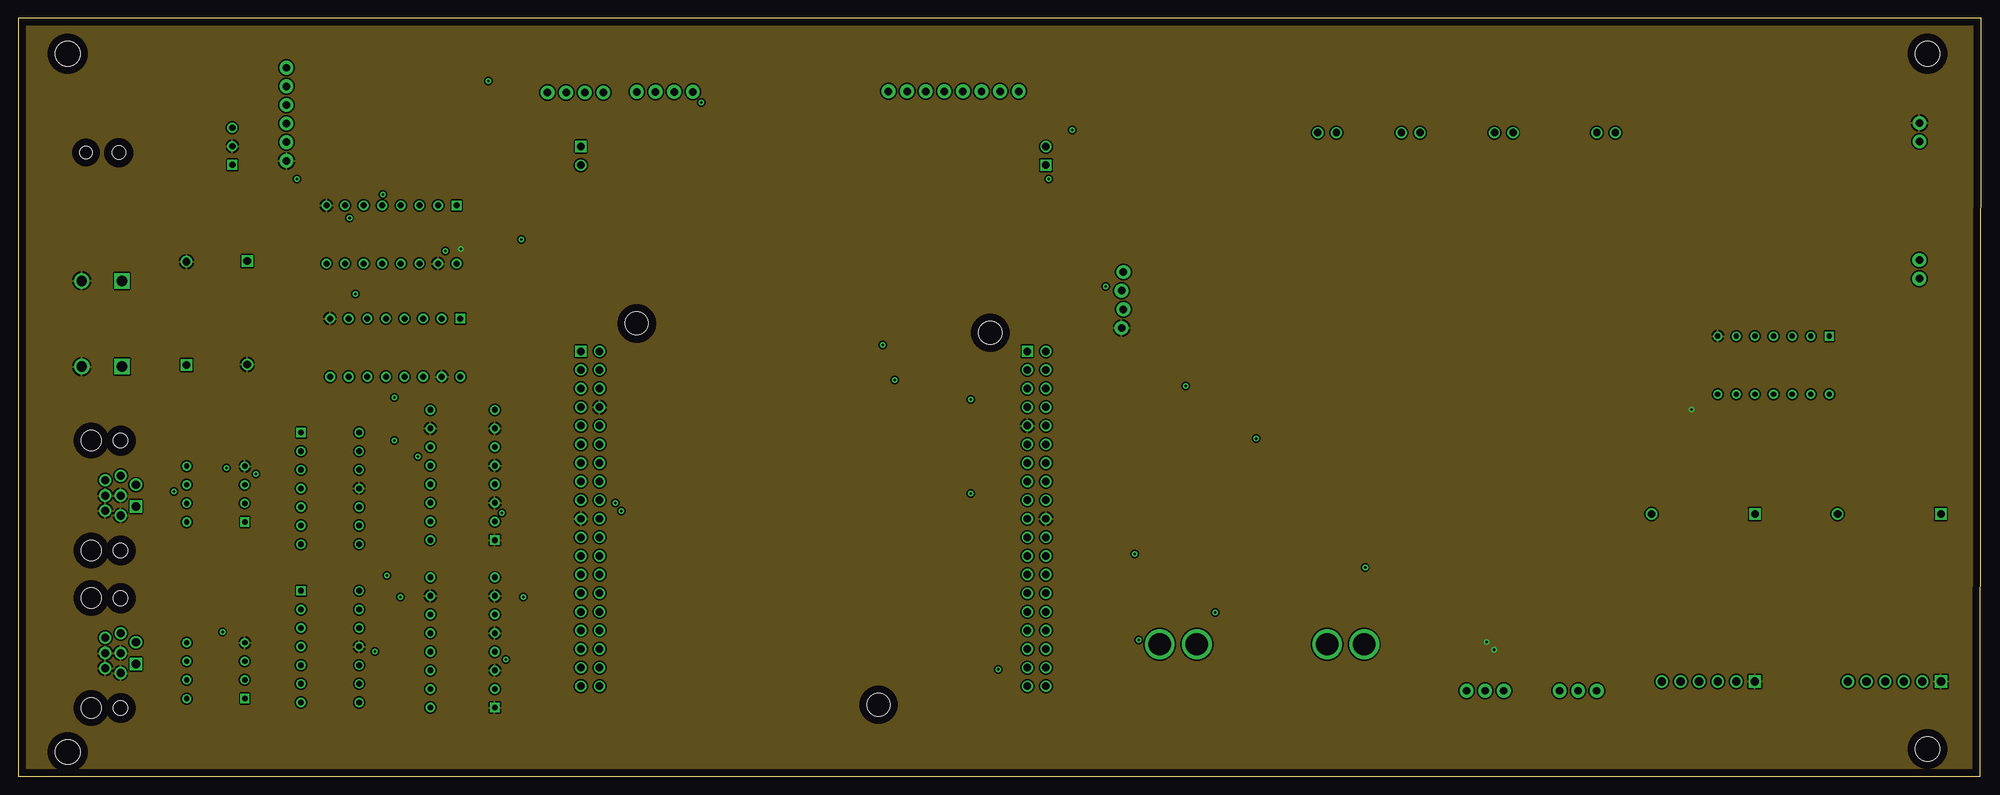
[diagram p3: board, inner layer Route15]
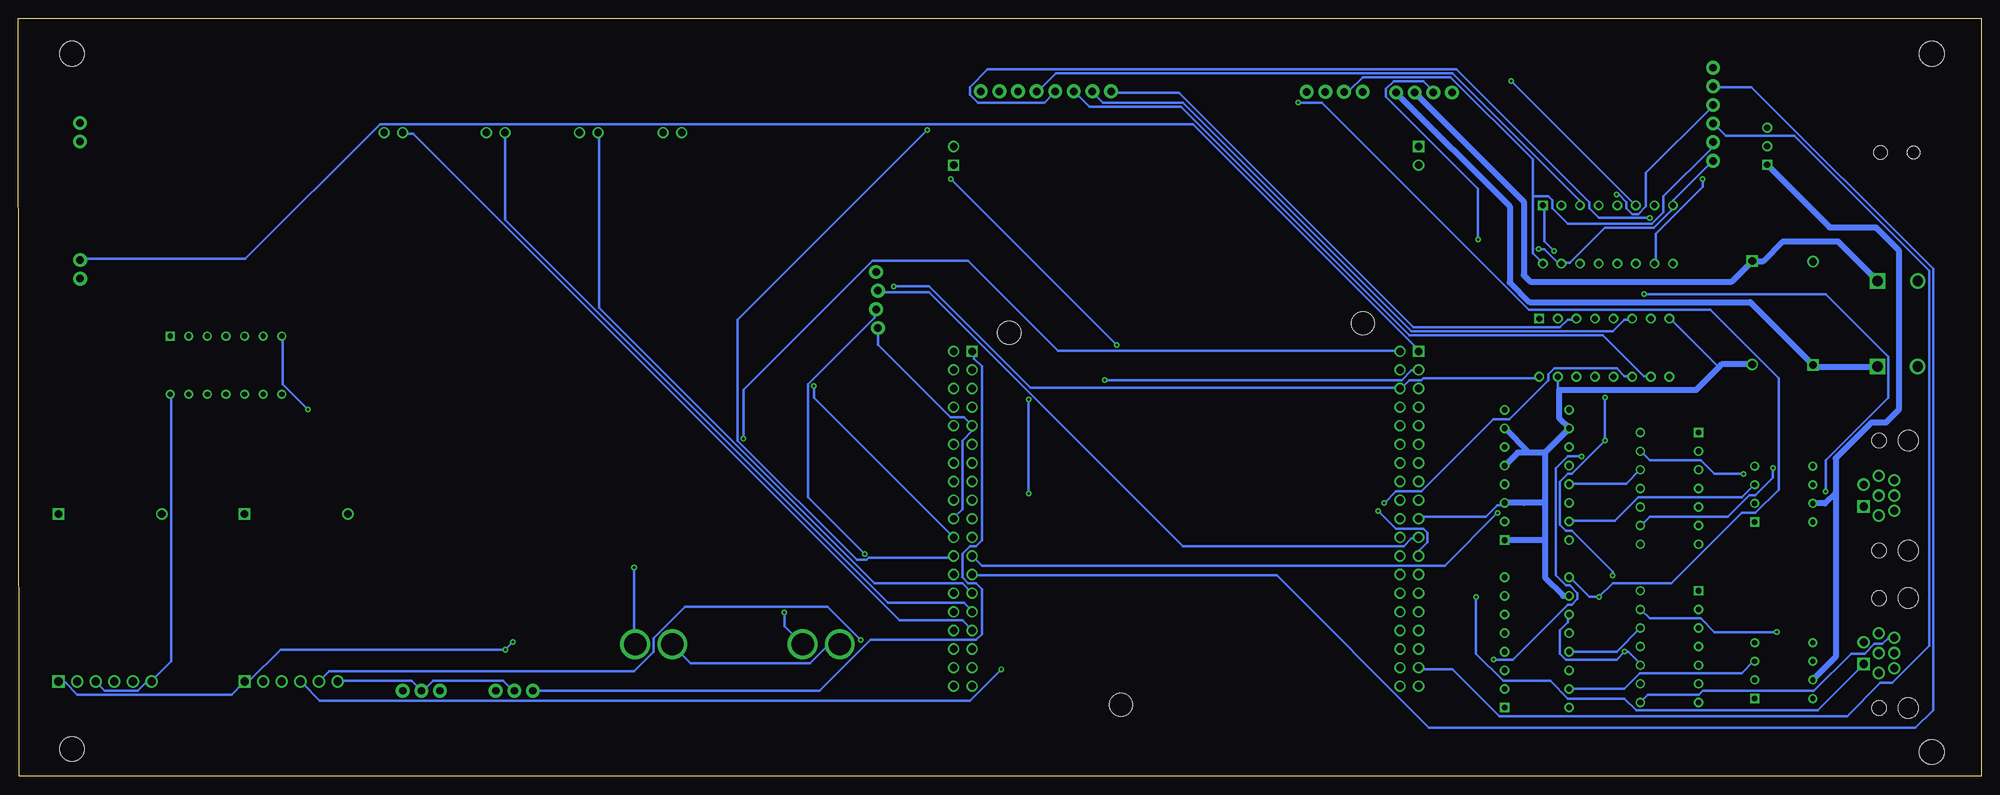
[diagram p4: board, bottom side, seen from below]

Size 268 x 103.46 mm. Coordinates in mm from the lower left corner, seen from the top.
Outline: 0,0 267.9,0 268,103.46 0,103.46 0,0
Copper layers (1+2*15+16): Top 0.035mm / dielectric 0.21mm / Route2 0.035mm / dielectric 1mm / Route15 0.035mm / dielectric 0.21mm / Bottom 0.035mm
Design rules "default *": minimum track width 13mil, minimum drill 0.35mm, track to track 8mil, track to pad 8mil, pad to pad 8mil, via to via 16mil, smd to smd 8mil, copper to edge 40mil, drill to drill 6mil, minimum pad ring 10mil, minimum via ring 8mil, stop-mask expansion 4mil, vias tented up to drill 0mil, thermal gap 10mil
Holes 3.4 mm at 6.76,98.62 6.76,3.32 260.66,3.72 260.66,98.62

### Footprints (pad centres in the part's own frame; a part is rotated, then mirrored left to right if it is on the bottom)
0603 = smd 1.1 x 1: 1 -0.85,0; 2 0.85,0
DIOAD1408W86L464D236 = drill 1.05 pad 1.575 square: 1 0,0 | drill 1.05 pad 1.575: 2 14.1,0
WL-TMRC_5MM = drill 1: 1 -1.27,0; 2 1.27,0
DIP880W60P254L1984H450Q16N = drill 0.8 pad 1.2 square: 1 -4.4,8.89 | drill 0.8 pad 1.2: 2 -4.4,6.35; 3 -4.4,3.81; 4 -4.4,1.27; 5 -4.4,-1.27; 6 -4.4,-3.81; 7 -4.4,-6.35; 8 -4.4,-8.89; 9 4.4,-8.89; 10 4.4,-6.35; 11 4.4,-3.81; 12 4.4,-1.27; 13 4.4,1.27; 14 4.4,3.81; 15 4.4,6.35; 16 4.4,8.89
DIP794W53P254L1930H508Q14N = drill 0.73 pad 1.13 square: 1 -3.97,7.62 | drill 0.73 pad 1.13: 2 -3.97,5.08; 3 -3.97,2.54; 4 -3.97,0; 5 -3.97,-2.54; 6 -3.97,-5.08; 7 -3.97,-7.62; 8 3.97,-7.62; 9 3.97,-5.08; 10 3.97,-2.54; 11 3.97,0; 12 3.97,2.54; 13 3.97,5.08; 14 3.97,7.62
DIP794W53P254L959H508Q8N = drill 0.73 pad 1.13 square: 1 -3.97,3.81 | drill 0.73 pad 1.13: 2 -3.97,1.27; 3 -3.97,-1.27; 4 -3.97,-3.81; 5 3.97,-3.81; 6 3.97,-1.27; 7 3.97,1.27; 8 3.97,3.81
1X04 = drill 1.016 pad 1.88: 1 0,0; 2 2.54,0; 3 5.08,0; 4 7.62,0
1X02 = drill 1.016 pad 1.88: 1 0,0; 2 2.54,0
MOLEX_460150202 = drill 1.4 pad 1.9 square: 1 0,0 | drill 1.4 pad 1.9: 2 0,-5.5
694108106102 = smd 2 x 2: 1 -3.075,5.5; 2 3.075,5.5; 3 -3.075,-5.5; 4 3.075,-5.5 | hole 1.7: -3.075,0 | hole 1.9: 1.425,0
1X04_LOCK = drill 1.016 pad 1.88: 1 0,0.127; 2 2.54,-0.127; 3 5.08,0.127; 4 7.62,-0.127
M12A08PMMRSF7003 = drill 1.1 pad 1.65 square: 1 0,0 | drill 1.1 pad 1.65: 2 -3,0; 3 -4.225,-2.1; 4 -3.575,-4.2; 5 -1.5,-4.2; 6 0.575,-4.2; 7 1.225,-2.1; 8 -1.5,-2.1 | hole 2.05: -9,-2.1; 6,-2.1 | hole 2.8: -9,-6.1; 6,-6.1
1X06 = drill 1.016 pad 1.88: 1 0,0; 2 2.54,0; 3 5.08,0; 4 7.62,0; 5 10.16,0; 6 12.7,0
1X03 = drill 1.016 pad 1.88: 1 0,0; 2 2.54,0; 3 5.08,0
1X08 = drill 1.016 pad 1.88: 1 0,0; 2 2.54,0; 3 5.08,0; 4 7.62,0; 5 10.16,0; 6 12.7,0; 7 15.24,0; 8 17.78,0
CONV_TSR_1-2450 = drill 0.85 square: 1 -2.54,-1.75 | drill 0.85: 2 0,-1.75; 3 2.54,-1.75
0402 = smd 0.85 x 0.9: 1 -0.58,0; 2 0.58,0
BOARD_NUCLEO-F411RE = drill 1.02 square: CN7_1 -31.75,9.51; CN10_1 29.21,9.51; CN11_1 31.75,34.91; CN12_1 -31.75,37.45 | drill 1.02: CN7_2 -29.21,9.51; CN7_3 -31.75,6.97; CN7_4 -29.21,6.97; CN7_5 -31.75,4.43; CN7_6 -29.21,4.43; CN7_7 -31.75,1.89; CN7_8 -29.21,1.89; CN7_9 -31.75,-0.65; CN7_10 -29.21,-0.65; CN7_11 -31.75,-3.19; CN7_12 -29.21,-3.19; CN7_13 -31.75,-5.73; CN7_14 -29.21,-5.73; CN7_15 -31.75,-8.27; CN7_16 -29.21,-8.27; CN7_17 -31.75,-10.81; CN7_18 -29.21,-10.81; CN7_19 -31.75,-13.35; CN7_20 -29.21,-13.35; CN7_21 -31.75,-15.89; CN7_22 -29.21,-15.89; CN7_23 -31.75,-18.43; CN7_24 -29.21,-18.43; CN7_25 -31.75,-20.97; CN7_26 -29.21,-20.97; CN7_27 -31.75,-23.51; CN7_28 -29.21,-23.51; CN7_29 -31.75,-26.05; CN7_30 -29.21,-26.05; CN7_31 -31.75,-28.59; CN7_32 -29.21,-28.59; CN7_33 -31.75,-31.13; CN7_34 -29.21,-31.13; CN7_35 -31.75,-33.67; CN7_36 -29.21,-33.67; CN7_37 -31.75,-36.21; CN7_38 -29.21,-36.21; CN10_2 31.75,9.51; CN10_3 29.21,6.97; CN10_4 31.75,6.97; CN10_5 29.21,4.43; CN10_6 31.75,4.43; CN10_7 29.21,1.89; CN10_8 31.75,1.89; CN10_9 29.21,-0.65; CN10_10 31.75,-0.65; CN10_11 29.21,-3.19; CN10_12 31.75,-3.19; CN10_13 29.21,-5.73; CN10_14 31.75,-5.73; CN10_15 29.21,-8.27; CN10_16 31.75,-8.27; CN10_17 29.21,-10.81; CN10_18 31.75,-10.81; CN10_19 29.21,-13.35; CN10_20 31.75,-13.35; CN10_21 29.21,-15.89; CN10_22 31.75,-15.89; CN10_23 29.21,-18.43; CN10_24 31.75,-18.43; CN10_25 29.21,-20.97; CN10_26 31.75,-20.97; CN10_27 29.21,-23.51; CN10_28 31.75,-23.51; CN10_29 29.21,-26.05; CN10_30 31.75,-26.05; CN10_31 29.21,-28.59; CN10_32 31.75,-28.59; CN10_33 29.21,-31.13; CN10_34 31.75,-31.13; CN10_35 29.21,-33.67; CN10_36 31.75,-33.67; CN10_37 29.21,-36.21; CN10_38 31.75,-36.21; CN11_2 31.75,37.45; CN12_2 -31.75,34.91 | hole 3.2: 8.89,-38.75; 24.13,12.05; -24.13,13.32
DIP794W45P254L1969H508Q14 = drill 0.77 pad 1.17 square: 1 -3.97,7.62 | drill 0.77 pad 1.17: 2 -3.97,5.08; 3 -3.97,2.54; 4 -3.97,0; 5 -3.97,-2.54; 6 -3.97,-5.08; 7 -3.97,-7.62; 8 3.97,-7.62; 9 3.97,-5.08; 10 3.97,-2.54; 11 3.97,0; 12 3.97,2.54; 13 3.97,5.08; 14 3.97,7.62
62A2202P = drill 1.11 pad 1.665 square: 1 0,0 | drill 1.11 pad 1.665: 2 -2.54,0; 3 -5.08,0; 4 -7.62,0; 5 -10.16,0; 6 -12.7,0
DIP794W45P254L1918H533Q16 = drill 0.82 square: 1 -3.97,8.89 | drill 0.82: 2 -3.97,6.35; 3 -3.97,3.81; 4 -3.97,1.27; 5 -3.97,-1.27; 6 -3.97,-3.81; 7 -3.97,-6.35; 8 -3.97,-8.89; 9 3.97,-8.89; 10 3.97,-6.35; 11 3.97,-3.81; 12 3.97,-1.27; 13 3.97,1.27; 14 3.97,3.81; 15 3.97,6.35; 16 3.97,8.89
PBS-33B = drill 3.048: + -2.54,0; - 2.54,0

### Placement (x,y rotation side)
C1  229.04,40.48 0 top
C2  253.34,41.53 180 top
D1  22.96,56.14 90 top
D2  237.11,35.8 180 top
D3  190.12,87.87 0 top
D4  178.69,87.87 0 top
D5  216.79,87.87 0 top
D6  202.82,87.87 0 top
D7  262.51,35.8 180 top
D8  31.26,70.32 270 top
IC1  60.66,41.13 180 top
IC2  60.66,18.27 180 top
IC3  239.65,56.12 270 top
IC4  26.96,14.42 180 top
IC5  26.96,38.52 180 top
J1  72.26,93.32 0 top
J2  259.56,67.92 90 top
J3  14.17,55.92 270 top
J4  12.3,85.13 0 top
J5  150.75,61.2 90 top
J6  14.16,67.62 270 top
J7  16.06,15.32 270 top
J8  36.62,84.01 90 top
J9  16.06,36.82 270 top
J10  197.74,11.67 0 top
J11  210.44,11.67 0 top
J14  259.57,86.64 90 top
J15  84.46,93.42 0 top
J23  118.81,93.5 0 top
PS1  27.48,86 90 top
R1  49.7,37.51 90 top
R2  34.36,16.32 90 top
R3  49.6,41.5 270 top
R4  49.8,20.21 270 top
R5  49.8,16.02 270 top
R6  34.26,40.32 90 top
R7  70.89,34.91 0 top
R8  70.59,39.69 0 top
R9  69.09,26.56 270 top
R10  70.49,44.77 0 top
R11  69.29,12.52 270 top
R12  69.29,17.6 270 top
R13  202.82,16.75 90 top
R14  69.19,22.68 270 top
R15  183.09,31.08 0 top
R16  164.03,30.98 0 top
R17  190.79,80.45 180 top
R18  179.36,80.35 180 top
R19  217.46,80.25 180 top
R20  203.49,80.35 180 top
R21  258.45,45.89 180 top
R22  236.98,41.42 90 top
R23  70.49,50.02 0 top
R24  228.84,44.73 180 top
R25  262.54,41.25 90 top
R26  67.16,59.22 270 top
R27  68.56,70.72 270 top
R28  197.74,16.75 90 top
R29  215.52,16.75 90 top
R30  210.44,16.75 90 top
R33  51.4,26.22 90 top
R34  52,47.71 180 top
U1  108.56,48.5 0 top
U2  42.57,39.29 0 top
U3  42.57,17.7 0 top
U4  262.51,12.94 0 top
U5  237.11,12.94 0 top
U6  51.46,58.51 270 top
U7  50.96,73.95 270 top
U$1  181.23,18.02 0 top
U$2  158.37,18.02 0 top

### Tracks (layer width: path | path; a pad name or v marks a point on that pad's centre or on a via)
GND  (via drill 0.35)
  Top 0.33: C2.1 254.33,41.54 257.8,45.01 257.8,45.81 R21.2 258.06,46.07 258.06,46.34 258.6,46.87 259.67,46.87 | 218.33,17.27 215.66,17.27 R29.2 | 218.33,17.27 224.46,11.14 235.4,11.14 237,12.74 U5.1 237,13 237,22.6 228.19,31.41 C1.1 | 218.33,17.27 218.33,33.01 228.19,42.87 228.19,44.47 R24.2 228.46,44.74 v228.46,50.07 | 259.67,46.87 264.47,42.07 264.47,14.87 262.6,13 U4.1 | 200.72,18.34 201.26,18.87 208.99,18.87 210.33,17.54 R30.2 | 200.72,18.34 199.92,17.54 197.79,17.54 R28.2 197.52,17.54 193.79,17.54 182.59,28.74 182.59,30.87 R15.1 182.32,31.14 164.72,31.14 | v201.53,17.27 202.59,17.27 R13.2 | 200.72,18.34 v200.46,18.34 | 164.72,31.14 146.85,49.01 139.65,49.01 138.58,47.94 137.78,47.94 U1.CN10_9 | 164.72,31.14 R16.2 | R3.2 49.77,40.74 49.6,40.39 | 38.08,40.58 38.04,40.74 37.76,40.9 | 8.97,48.64 8.97,48.74 8.67,48.76 | 8.66,56.21 8.7,56.21 J3.2 | v60.44,71.94 62.04,70.34 68.44,70.34 R27.2 | 190.06,80.21 189.26,79.41 179.39,79.41 178.86,79.94 178.86,80.21 R18.2 | 202.59,80.21 192.72,80.21 191.92,79.41 190.86,79.41 190.06,80.21 | 202.59,80.21 202.86,80.21 R20.2 202.59,80.21 | 190.06,80.21 R17.2 | 202.59,80.21 203.39,79.41 204.72,79.41 205.53,80.21 216.73,80.21 R19.2 216.73,80.48 216.73,99.82 | R26.2 67.38,58.34 68.18,58.34 74.84,51.67 78.04,51.67 79.11,50.61 U1.CN7_8 79.11,50.34 79.11,49.28 78.04,48.21 78.04,36.47 76.98,35.41 U1.CN7_19 | 59.11,19.54 59.11,19.67 58.76,19.67 | J8.1 36.44,84.21 31.1,84.21 29.5,85.81 PS1.2 | 37.63,16.9 38.04,16.74 38.08,16.45 | 259.67,46.87 259.67,66.08 261,67.41 261,87.95 259.93,89.01 J14.2
  Top 0.813: J4.3 J4.4 22.96,72.04 D1.2 31.26,61.94 D8.2 | 9.22,68.19 J4.3 | J6.2 8.66,56.21 8.66,55.94 | 7.14,40.97 J9.6 | J9.6 J9.5 J9.8 | 7.14,40.97 7.14,27.52 | 7.14,27.52 7.14,19.47 J7.6 | J7.6 J7.5 J7.8 | J7.6 13.31,14.75 J7.7 | J9.6 13.31,36.25 J9.7 | J4.3 9.22,81.92 6.95,84.19 6.95,92.61 9.26,94.92 20.31,94.92 | PS1.2 20.31,94.92 | 20.31,94.92 25.21,99.82 213.79,99.82 216.73,99.82 248.93,99.82 J14.2 | IC2.10 58.76,22.12 58.76,20.02 58.76,19.67 58.76,19.52 58.76,9.42 56.86,7.52 53.26,7.52 49.8,10.98 R5.2 48.8,15.44 U3.11 | 62.36,19.54 59.11,19.54 58.78,19.54 | IC2.5 62.36,19.54 | 62.36,19.54 62.36,21.92 IC2.7 | 62.36,19.54 62.36,17.16 | 62.36,17.16 IC2.3 | 62.36,17.16 62.36,12.08 IC2.1 | 7.14,27.52 21.64,27.52 IC4.4 33.03,18.23 R2.2 37.63,16.9 | 38.08,16.45 45.29,16.45 U3.11 | 37.76,40.9 R6.2 32.83,42.33 IC5.4 30.93,43.25 28.96,45.22 18.02,45.22 14.6,48.64 8.97,48.64 8.79,48.64 7.14,46.99 7.14,40.97 | 38.08,40.58 45.25,40.58 U2.11 48.5,39.29 | 48.5,39.29 R1.2 | 48.5,39.29 49.6,40.39 | U3.11 48.47,19.63 R4.2 | J3.2 8.67,48.76
  Bottom 0.33: v228.46,50.07 231.93,53.54 231.93,59.94 IC3.7 | U4.1 262.33,12.74 261.53,12.74 259.93,11.14 238.86,11.14 237.26,12.74 U5.1 237,13 236.46,13 232.19,17.27 v201.53,17.27 v200.46,18.34 | U1.CN10_20 140.18,35.41 139.12,36.47 139.12,45.81 137.78,47.14 137.78,47.67 U1.CN10_9 137.78,47.94 138.85,49.01 140.72,49.01 150.59,58.88 150.59,61.01 J5.1 | v60.44,71.94 59.64,71.94 57.51,69.81 U7.15 57.24,70.08 56.17,70.08 51.37,74.88 44.71,74.88 42.31,77.28 42.31,77.81 U7.8 42.04,78.08 42.04,78.61 36.7,83.95 J8.1 | 35.82,55.86 42.31,62.34 U6.8 | U6.15 57.77,54.34 57.77,53.01 57.66,52.72 | U1.CN7_19 76.71,35.41 67.64,35.41 66.04,37.01 65.24,37.01 IC1.3 | 59.91,32.24 59.91,32.21 59.56,32.21
  Bottom 0.813: 59.56,44.18 IC1.10 57.66,48.88 57.66,52.72 38.96,52.72 35.82,55.86 35.46,56.22 D8.2 | 59.56,44.18 59.56,37.32 | 59.56,44.18 61.76,44.18 | 61.76,44.18 IC1.7 | 61.76,44.18 63.28,44.18 IC1.5 | 59.56,37.32 62.46,37.32 IC1.3 | IC2.10 57.06,24.62 59.56,27.12 59.56,32.02 59.56,32.21 59.56,37.32 | 59.78,32.24 59.91,32.24 IC1.1
  pour Route2: 0.06,103.52 268.06,103.52 268.06,-0.08 0.06,-0.08
  pour Route15: 0.06,103.52 268.06,103.52 268.06,-0.08 0.06,-0.08 0.06,103.32
N$1
  Top 0.33: R28.1 197.79,16.2 199.39,16.2 201.53,18.34 203.39,18.34 204.19,17.54 204.19,11.14 203.39,10.34 199.12,10.34 197.79,11.67 J10.1
  Bottom 0.33: J10.1 158.59,11.67 151.65,18.6 137.25,18.6 136.45,19.4 136.45,25.54 137.25,26.34 138.32,26.34 139.12,27.14 139.12,30.34 138.05,31.41 137.25,31.41 136.45,32.21 136.45,55.94 137.52,57.01 137.52,57.81 U1.CN10_1
N$2  (via drill 0.35)
  Top 0.33: U2.8 46.57,31.67 46.57,34.07 U2.9 | v28.44,42.07 27.1,43.41 14.57,43.41 12.7,41.54 12.7,41.27 11.9,40.47 J9.4
  Bottom 0.33: v28.44,42.07 28.44,40.74 30.84,38.34 31.64,38.34 34.57,35.41 45.24,35.41 46.31,34.34 U2.9
N$3
  Top 0.33: D7.1 262.6,35.94 262.6,40.47 R25.1 262.33,40.47 253.53,40.47 252.73,41.27 C2.2 252.46,41.54 246.06,47.94 246.06,52.47 245.26,53.28 236.73,53.28 235.66,52.21 234.59,52.21 IC3.9
N$4  (via drill 0.35)
  Top 0.33: v52.17,24.47 51.64,25 51.64,25.54 R33.1 | v93.24,91.95 134.58,91.95 135.92,93.28 136.45,93.28 J23.8
  Bottom 0.33: IC2.9 56.17,27.14 53.51,24.47 v52.17,24.47 50.31,26.34 42.31,26.34 32.7,35.94 30.84,35.94 27.64,39.14 27.64,54.34 36.97,63.68 61.77,63.68 90.04,91.95 v93.24,91.95
N$5
  Top 0.33: R11.2 69.24,11.94 65.24,11.94 IC2.2
N$6
  Bottom 0.813: J1.3 62.46,78.44 62.46,68.42 61.56,67.52 34.06,67.52 D8.1 29.76,70.32 27.06,73.02 19.56,73.02 J6.1
N$7  (via drill 0.35)
  Top 0.33: U3.13 46.57,22.87 46.57,25.27 U3.14 | v27.9,19.67 14.03,19.67 J7.3
  Bottom 0.33: v27.9,19.67 36.44,19.67 38.3,21.54 45.24,21.54 46.31,22.6 U3.13
N$8
  Top 0.33: R9.1 68.97,27.14 65.24,27.14 IC2.8
N$9  (via drill 0.35)
  Top 0.33: v50.31,27.41 50.84,26.87 51.37,26.87 R33.2 | v51.37,45.81 51.37,47.67 R34.2 | PS1.3 29.24,88.48 34.57,88.48 36.44,86.61 J8.2 | U7.16 59.91,69.81 60.71,69.81 71.11,59.41 77.51,59.41 78.04,58.88 78.04,54.07 79.11,53.01 U1.CN7_6 | v51.37,51.67 52.97,53.28 59.11,53.28 60.17,54.34 U6.16 | v152.45,30.34 152.45,21.27 155.65,18.07 U$2.+ | IC3.14 247.4,52.21 247.4,55.68 259.4,67.68 J2.1 | U5.6 224.46,12.74 225.26,12.74 226.33,11.67 230.86,11.67 231.93,12.74 U5.3 | U4.6 249.8,12.74 239.13,12.74 236.73,10.34 214.33,10.34 212.99,11.67 J11.2 | U$1.+ 178.86,17.8 180.46,17.8 185.26,13 198.86,13 200.19,11.67 J10.2 | v148.45,66.88 148.45,66.34 150.85,63.94 J5.2
  Bottom 0.33: v50.31,27.41 50.31,27.94 55.91,33.54 56.71,33.54 57.51,34.34 57.51,40.21 56.44,41.27 55.91,41.27 v51.37,45.81 v51.37,51.67 | U6.16 60.44,54.34 76.18,54.34 76.44,54.07 78.04,54.07 79.11,53.01 U1.CN7_6 79.38,53.01 129.78,53.01 143.65,66.88 v148.45,66.88 | 61.24,79.14 61.24,71.41 59.91,70.08 U7.16 | 61.24,79.14 61.24,84.21 72.44,95.41 84.44,95.41 86.31,93.55 86.84,93.55 J15.2 | 61.24,79.14 59.11,79.14 58.57,78.61 58.57,77.54 56.44,75.41 44.97,75.41 43.37,77.01 43.37,79.14 36.7,85.81 36.7,86.35 J8.2 | v152.45,30.34 160.19,38.07 160.19,53.54 151.12,62.61 151.12,63.68 J5.2 | U4.3 257.26,12.74 256.2,11.67 251.66,11.67 250.6,12.74 250.06,12.74 U4.6 249.8,13 247.13,15.67 247.13,51.94 IC3.14 | J10.2 200.46,11.67 201.79,13 211.39,13 212.73,11.67 J11.2 212.99,11.67 214.33,13 224.19,13 U5.6 | U$2.+ 155.92,17.8 157.52,17.8 159.92,15.4 176.19,15.4 178.59,17.8 U$1.+
N$10
  Top 0.33: U3.8 46.57,10.34 46.57,12.47 U3.9
  Bottom 0.33: J7.4 11.9,18.87 12.7,18.87 13.5,18.07 14.57,18.07 15.9,16.74 17.77,16.74 22.84,11.67 38.04,11.67 38.57,11.14 45.5,11.14 46.31,10.34 U3.8
N$11
  Bottom 0.33: 22.74,55.92 22.84,55.94 D1.1
  Bottom 0.813: J1.4 64.36,77.8 64.36,67.42 61.66,64.72 31.54,64.72 D1.1 | 22.74,55.92 J3.1
N$12  (via drill 0.35)
  Top 0.33: v68.97,24.47 68.97,25.81 R9.2
  Bottom 0.33: v68.97,24.47 68.97,16.74 65.24,13 58.84,13 56.44,10.6 48.71,10.6 47.1,9 22.3,9 16.17,15.14 J7.1
N$13
  Top 0.33: R8.2 71.11,39.94 71.11,40.21 70.57,40.74 66.04,40.74 65.24,39.94 IC1.4
N$14
  Top 0.33: J7.2 16.17,18.07 18.3,15.94 22.84,15.94 IC4.6 23.1,15.67 25.5,13.27 30.84,13.27 IC4.2
N$15
  Top 0.33: R10.1 69.78,44.74 66.31,44.74 65.24,43.67 64.71,43.67 62.04,46.34 62.04,55.14 56.97,60.21 47.37,60.21 45.24,62.34 U6.7
N$16
  Top 0.33: R6.1 34.04,39.94 31.1,39.94 IC5.3
  Bottom 0.33: IC1.15 56.17,34.87 50.04,34.87 46.84,38.07 32.7,38.07 31.1,39.67 IC5.3
N$17  (via drill 0.35)
  Top 0.33: v38.04,81.54 49.77,81.54 63.91,95.68 131.92,95.68 134.05,93.55 J23.7
  Bottom 0.33: v38.04,81.54 38.04,80.48 44.44,74.08 44.44,70.08 U7.10
N$19  (via drill 0.35)
  Top 0.33: v64.17,94.88 130.05,94.88 131.38,93.55 J23.6
  Bottom 0.33: v64.17,94.88 47.37,78.08 U7.6
N$20
  Top 0.33: R23.1 69.78,50.07 65.24,50.07 IC1.8
N$21
  Top 0.33: J9.2 16.17,39.67 22.84,39.67 IC5.6 23.1,39.67 25.5,37.27 30.84,37.27 IC5.2
N$22
  Bottom 0.33: U7.3 54.84,78.08 54.84,78.61 72.18,95.95 126.31,95.95 128.72,93.55 J23.5
N$23  (via drill 0.35)
  Top 0.33: v68.71,73.28 68.71,71.41 | v82.31,36.21 82.31,57.81 68.71,71.41 | 68.71,71.41 R27.1
  Bottom 0.33: v68.71,73.28 68.71,80.21 81.24,92.75 81.24,93.81 80.18,94.88 76.18,94.88 74.84,93.55 J1.2 | v82.31,36.21 79.91,33.81 76.18,33.81 75.64,33.27 75.64,31.94 76.71,30.87 76.71,30.07 U1.CN7_23
N$25  (via drill 0.35)
  Top 0.33: v163.39,22.34 163.39,30.87 R16.1 163.39,31.14 147.92,46.61 139.92,46.61 139.12,45.81 139.12,44.74 139.92,43.94 140.98,43.94 141.52,43.41 141.52,37.27 140.72,36.47 137.25,36.47 v119.65,54.07
  Bottom 0.33: v163.39,22.34 163.39,20.47 160.99,18.07 U$2.- | v119.65,54.07 79.11,54.07 77.78,55.41 76.98,55.41 U1.CN7_3
N$26  (via drill 0.35)
  Top 0.33: v183.92,28.47 183.92,30.87 R15.2 183.92,31.14 v168.99,46.07
  Bottom 0.33: v183.92,28.47 183.92,18.07 U$1.- | v168.99,46.07 168.99,52.74 151.38,70.34 138.32,70.34 126.05,58.08 79.38,58.08 U1.CN7_2
N$27  (via drill 0.35)
  Top 0.33: v159.39,53.28 232.46,53.28 233.26,52.47 233.26,51.94 234.06,51.14 240.2,51.14 241,51.94 242.06,51.94 IC3.12
  Bottom 0.33: v159.39,53.28 159.39,51.67 140.45,32.74 U1.CN10_22
N$28  (via drill 0.35)
  Top 0.33: v81.51,37.27 81.51,22.07 79.38,19.94 U1.CN7_32
  Bottom 0.33: v81.51,37.27 79.91,38.87 76.44,38.87 66.57,48.74 64.44,48.74 59.11,54.07 59.11,54.88 58.31,55.68 49.77,55.68 48.71,54.61 47.91,54.61 U6.11
N$29  (via drill 0.35)
  Top 0.33: v48.71,17 48.97,16.74 49.77,16.74 R5.1
  Bottom 0.33: U3.10 46.57,15.4 48.17,17 v48.71,17 49.77,15.94 56.71,15.94 57.51,16.74 57.51,19.94 56.44,21 56.44,22.07 IC2.11
N$30
  Top 0.33: U1.CN7_37 76.98,12.2 77.78,12.2 83.11,6.87 250.6,6.87 256.2,12.47 256.2,13.54 255.4,14.34 253.8,14.34 252.46,13 U4.5
N$32
  Top 0.33: R12.1 69.51,18.34 73.51,18.34 76.44,21.27 79.91,21.27 80.71,22.07 80.71,58.34 69.78,69.28 62.04,69.28 55.11,76.21 46.31,76.21 44.71,77.81 U7.7
N$34
  Top 0.33: R7.2 71.38,34.87 71.38,34.34 71.11,34.07 65.77,34.07 65.24,34.61 IC1.2
N$35
  Top 0.813: J4.1 J4.2 22.55,83.46 PS1.1 32.16,80.53 66.86,80.53 76.65,80.53 79.19,80.53 80.06,80.53 | 80.06,80.53 83.16,80.53 | 83.16,80.53 169.96,80.53 174.36,76.12 249.05,76.12 J14.1 | 53.21,35.29 53.21,39.12 | IC1.16 53.21,35.29 | 53.21,35.29 53.21,30.22 53.21,29.22 53.21,28.42 | 53.21,22.59 53.21,28.42 | 53.21,22.59 IC2.12 | 53.21,22.59 53.21,17.51 | 53.21,17.51 IC2.14 | 53.21,17.51 53.21,12.43 IC2.16 | 83.16,80.53 92.08,89.44 J15.4 | J15.3 89.54,90 80.06,80.53 | 53.21,39.12 54.46,39.12 IC1.14 | 53.21,28.42 36.56,28.42 | 36.56,28.42 31.82,28.42 IC5.7 | 36.56,28.42 36.56,37.25 U2.4 | 36.56,28.42 36.56,19.74 U3.4 | 53.21,39.12 53.21,39.35 IC1.12
  Bottom 0.813: PS1.1 20.69,74.92 14.36,74.92 11.26,71.82 11.26,50.02 13.01,48.27 14.97,48.27 19.86,43.38 19.86,38.72 | 19.86,38.72 21.33,37.25 IC5.7 | 19.86,38.72 19.86,16.28 IC4.7
N$36
  Top 0.33: R7.1 70.57,35.14 70.57,37.54 72.18,39.14 72.18,40.21 71.11,41.27 64.71,41.27 61.51,44.47 61.51,54.88 56.71,59.68 46.31,59.68 43.91,62.08 43.91,62.88 44.71,63.68 45.5,63.68 46.57,62.61 46.57,62.08 47.91,60.74 51.11,60.74 52.71,62.34 U6.4
N$38
  Top 0.33: R10.2 70.84,45.01 70.84,45.27 70.31,45.81 66.04,45.81 65.24,45.01 IC1.6
N$39
  Top 0.33: R12.2 69.24,17 65.24,17 IC2.4
N$40
  Top 0.33: U7.2 57.51,77.81 58.04,77.81 61.77,74.08 103.91,74.08 137.52,40.47 U1.CN10_15
N$41
  Top 0.33: R21.1 259.13,45.81 259.13,45.27 262.33,42.07 R25.2 262.6,42.07 263.93,40.74 263.93,34.87 263.67,34.61 261.53,34.61 | 261.53,34.61 260.47,35.67 248.46,35.67 D7.2 | 261.53,34.61 260.2,33.27 260.2,13 U4.2
N$42  (via drill 0.35)
  Top 0.33: v66.57,15.94 69.24,13.27 R11.1 | v54.57,43.67 47.37,43.67 46.84,43.14 46.31,43.14 39.9,49.54 39.9,74.08 43.37,77.54 43.37,78.34 44.17,79.14 47.64,79.14 48.44,78.34 48.44,77.54 49.24,76.75 51.11,76.75 52.17,77.81 U7.4
  Bottom 0.33: v66.57,15.94 63.91,15.94 56.44,23.41 55.91,23.41 55.11,24.2 55.11,25 56.17,26.07 56.71,26.07 58.04,27.41 58.04,42.07 56.44,43.67 v54.57,43.67
N$43  (via drill 0.35)
  Top 0.33: v152.99,18.6 139.92,18.6 139.12,17.8 139.12,17 138.32,16.2 137.52,16.2 135.12,13.8 118.05,13.8 116.71,12.47 79.38,12.47 U1.CN7_38
  Bottom 0.33: v152.99,18.6 157.52,23.14 176.99,23.14 181.25,18.87 181.25,17 183.92,14.34 225.53,14.34 226.86,13 U5.5
N$44  (via drill 0.35)
  Top 0.33: IC1.9 56.17,49.81 54.31,47.94 52.71,47.94 R34.1 52.44,47.94 52.44,48.21 50.84,49.81 44.97,49.81 40.97,53.81 40.97,67.41 43.37,69.81 43.37,74.34 v45.24,76.21
  Bottom 0.33: v45.24,76.21 52.17,76.21 53.51,77.54 53.51,78.34 71.64,96.48 135.65,96.48 138.05,94.08 138.05,93.01 136.98,91.95 127.92,91.95 126.58,93.28 J23.4
N$45  (via drill 0.35)
  Top 0.33: U2.13 46.57,44.47 46.57,46.87 U2.14 | v32.44,41.27 14.03,41.27 J9.3
  Bottom 0.33: v32.44,41.27 36.44,41.27 38.3,43.14 45.24,43.14 46.31,44.21 U2.13
N$46
  Top 0.33: U1.CN10_34 140.45,17.27 152.99,17.27 160.99,9.27 251.4,9.27 254.87,12.74 U4.4
N$47
  Top 0.33: 237,40.47 237,35.94 D2.1 | 237,40.47 237,40.74 R22.1 | C1.2 230.06,40.74 236.73,40.74 R22.1 | IC3.13 244.73,48.21 237,40.47 | 237,40.47 R22.1
N$49  (via drill 0.35)
  Top 0.33: v140.72,81.54 146.85,87.68 177.25,87.68 D4.1 | v118.05,58.88 118.05,56.21 79.38,17.54 U1.CN7_34
  Bottom 0.33: v118.05,58.88 v140.72,81.54
N$50
  Top 0.33: U1.CN10_17 137.78,37.81 137.78,38.61 139.12,39.94 139.12,43.14 138.32,43.94 137.52,43.94 136.45,45.01 136.45,55.94 137.25,56.74 138.58,56.74 139.12,57.28 139.12,58.61 149.25,68.74 150.85,68.74 J5.4
N$51
  Top 0.33: R20.1 204.19,80.48 204.19,87.68 D6.2
N$52
  Top 0.33: D5.2 218.06,80.48 R19.1
N$53
  Top 0.33: R18.1 179.92,80.48 179.92,87.68 D4.2
N$54
  Top 0.33: D3.2 191.39,80.48 R17.1
N$55  (via drill 0.35)
  Top 0.33: v130.05,38.61 137.25,31.41 138.05,31.41 139.12,30.34 139.12,29.54 140.18,28.47 140.18,27.67 U1.CN10_26 | v130.05,51.41 101.78,79.68 50.04,79.68 v49.77,79.41
  Bottom 0.33: v130.05,51.41 v130.05,38.61 | v49.77,79.41 49.51,79.41 48.44,78.34 48.44,77.54 47.64,76.75 46.84,76.75 45.77,77.81 45.77,82.34 36.7,91.41 J8.4
N$56
  Bottom 0.33: U1.CN10_25 137.52,27.41 96.18,27.41 75.38,6.6 8.97,6.6 6.57,9 6.57,69.28 31.37,94.08 36.44,94.08 J8.5
N$57
  Top 0.33: R14.1 68.97,23.41 67.91,23.41 65.24,26.07 64.44,26.07 57.51,33.01 57.51,45.27 56.71,46.07 52.71,46.07 51.64,45.01 50.04,45.01 45.77,49.28 44.71,49.28 40.44,53.54 40.44,68.21 42.04,69.81 U7.9
N$58  (via drill 0.35)
  Top 0.33: v46.04,65.81 48.71,63.14 48.71,62.34 49.77,61.28 50.57,61.28 51.37,62.08 51.37,62.61 52.44,63.68 53.24,63.68 53.77,63.14 53.77,62.34 54.84,61.28 56.71,61.28 65.51,52.47 68.97,52.47 70.84,50.61 70.84,50.07 R23.2 | v21.24,38.87 18.03,38.87 16.17,37.01 J9.1
  Bottom 0.33: v46.04,65.81 21.24,65.81 12.7,57.28 12.7,51.67 21.24,43.14 v21.24,38.87
N$60
  Top 0.33: U7.5 49.77,78.08 50.84,78.08 51.91,79.14 101.25,79.14 137.52,42.87 U1.CN10_13
N$61
  Top 0.33: U6.5 50.31,62.61 51.91,64.21 55.11,64.21 56.71,62.61 56.71,62.08 65.77,53.01 69.51,53.01 75.11,47.41 75.11,25 76.44,23.67 78.04,23.67 79.11,22.6 U1.CN7_30
N$62
  Top 0.33: U6.2 58.04,62.34 58.57,62.34 67.38,53.54 69.78,53.54 75.64,47.67 75.64,29.54 76.44,28.74 77.24,28.74 78.04,27.94 78.04,26.07 79.11,25 U1.CN7_28
N$65
  Bottom 0.33: D3.1 188.72,87.68 188.72,63.94 151.12,26.34 139.12,26.34 137.78,25 U1.CN10_27
N$66
  Bottom 0.33: D6.1 201.53,87.68 201.53,75.94 149.25,23.67 138.85,23.67 137.78,22.6 U1.CN10_29
N$67
  Bottom 0.33: U1.CN7_21 76.98,32.47 77.78,32.47 78.84,31.41 108.98,31.41 143.65,66.08 150.59,66.08 J5.3
N$68
  Bottom 0.33: U6.10 45.24,54.61 46.04,54.61 51.64,60.21 78.04,60.21 109.25,91.41 121.78,91.41 123.65,93.28 J23.3
N$69
  Bottom 0.33: U6.6 47.91,62.34 48.71,62.34 50.31,60.74 77.78,60.74 108.98,91.95 119.91,91.95 121.25,93.28 J23.2
N$70
  Bottom 0.33: D5.1 215.39,87.68 214.06,87.68 147.65,21.27 139.12,21.27 137.78,19.94 U1.CN10_31
N$71  (via drill 0.35)
  Top 0.33: v66.04,35.94 64.97,35.94 60.17,40.74 60.17,47.67 56.71,51.14 55.91,51.14 55.11,50.34 45.24,50.34 41.5,54.07 41.5,62.88 47.1,68.48 47.1,69.81 U7.11
  Bottom 0.33: v66.04,35.94 73.24,28.74 136.45,28.74 137.52,29.81 U1.CN10_23
N$73  (via drill 0.35)
  Top 0.33: v133.78,14.6 79.38,14.6 U1.CN7_36
  Bottom 0.33: v133.78,14.6 138.05,10.34 226.86,10.34 229.26,12.74 U5.4
N$74
  Bottom 0.33: U6.3 55.37,62.34 56.44,62.34 57.51,61.28 77.51,61.28 109.51,93.28 118.58,93.28 J23.1
N$75
  Top 0.33: 230.06,43.94 229.53,44.47 R24.1 | 230.06,43.94 231.93,42.07 236.73,42.07 R22.2 | 230.06,43.94 223.13,37.01 223.13,35.94 D2.2 223.13,35.67 234.33,24.47 234.33,13 U5.2
N$76  (via drill 0.35)
  Top 0.33: v143.92,88.21 135.65,96.48 36.7,96.48 J8.6
  Bottom 0.33: v143.92,88.21 169.79,62.34 169.79,45.81 153.52,29.54 152.19,29.54 151.92,29.81 140.45,29.81 U1.CN10_24
N$77
  Top 0.33: IC3.8 231.93,52.21 140.98,52.21 140.45,52.74 U1.CN10_6
N$78
  Bottom 0.33: U1.CN7_35 76.71,14.6 72.18,14.6 65.77,8.2 18.3,8.2 13.77,12.74 12.17,12.74 7.1,17.8 7.1,69.01 25.5,87.41 34.84,87.41 36.44,89.01 J8.3
N$81  (via drill 0.35)
  Top 0.33: v58.31,71.68 58.31,70.61 58.57,70.34 58.57,64.21 60.17,62.61 U6.1 60.44,62.34 62.57,60.21 67.11,60.21 R26.1 67.38,59.94 69.24,58.08 76.71,58.08 U1.CN7_1
  Bottom 0.33: v58.31,71.68 59.64,73.01 59.64,77.81 U7.1 | J2.2 259.4,70.61 237,70.61 218.59,89.01 107.65,89.01 76.71,58.08 U1.CN7_1
N$82
  Top 0.33: 202.86,15.14 202.86,11.67 J10.3 | 202.86,15.14 202.86,15.94 R13.1 | 202.86,15.14 195.39,15.14 190.06,20.47 164.19,20.47 162.59,22.07 162.59,23.14 140.45,45.27 U1.CN10_12
N$84
  Top 0.33: J11.3 215.66,11.67 215.66,15.94 R29.1 215.39,15.94 179.66,51.67 139.92,51.67 139.12,52.47 139.12,53.54 140.18,54.61 140.18,55.41 U1.CN10_4
N$87
  Top 0.33: R30.1 210.59,15.94 210.59,11.67 J11.1 210.33,11.67 208.46,9.8 174.06,9.8 150.05,33.81 139.92,33.81 138.58,35.14 137.78,35.14 U1.CN10_19
N$88
  Top 0.33: R3.1 49.51,42.07 46.57,42.07 U2.12
  Bottom 0.33: IC1.13 56.17,39.94 48.44,39.94 46.57,41.81 U2.12
N$89
  Top 0.33: R4.1 49.77,20.74 46.84,20.74 46.57,20.47 U3.12
  Bottom 0.33: IC2.13 56.17,17 49.77,17 46.57,20.2 U3.12
N$94
  Top 0.33: R14.2 68.97,22.07 65.24,22.07 IC2.6
N$99
  Top 0.33: R8.1 69.78,39.67 66.57,39.67 65.51,38.61 64.71,38.61 60.71,42.61 60.71,47.94 56.97,51.67 52.44,51.67 51.64,50.88 46.04,50.88 42.57,54.34 U6.9
N$105
  Top 0.33: U2.10 46.57,37.01 49.51,37.01 R1.1 49.77,36.74 50.57,37.54 50.57,38.34 56.17,43.94 56.17,44.74 IC1.11
N$107
  Top 0.33: R2.1 34.3,15.94 31.1,15.94 IC4.3
  Bottom 0.33: IC2.15 56.17,11.94 48.71,11.94 46.57,14.07 32.7,14.07 31.1,15.67 IC4.3

### Text on the board
tNames: DV | Nucleo | B1 | B2 | DV | Nucleo | B1 | B2 | STP+_X | EN+_x | DIR+_X | HLFB+_X | STP+_Z | DIR+_Z | EN+_Z | HLFB+_Z | OFF | ON | Manual | SCL | SDA | VCC | GND